# EAGLE board memory (EAGLE 6.6.0), part 1 of 9
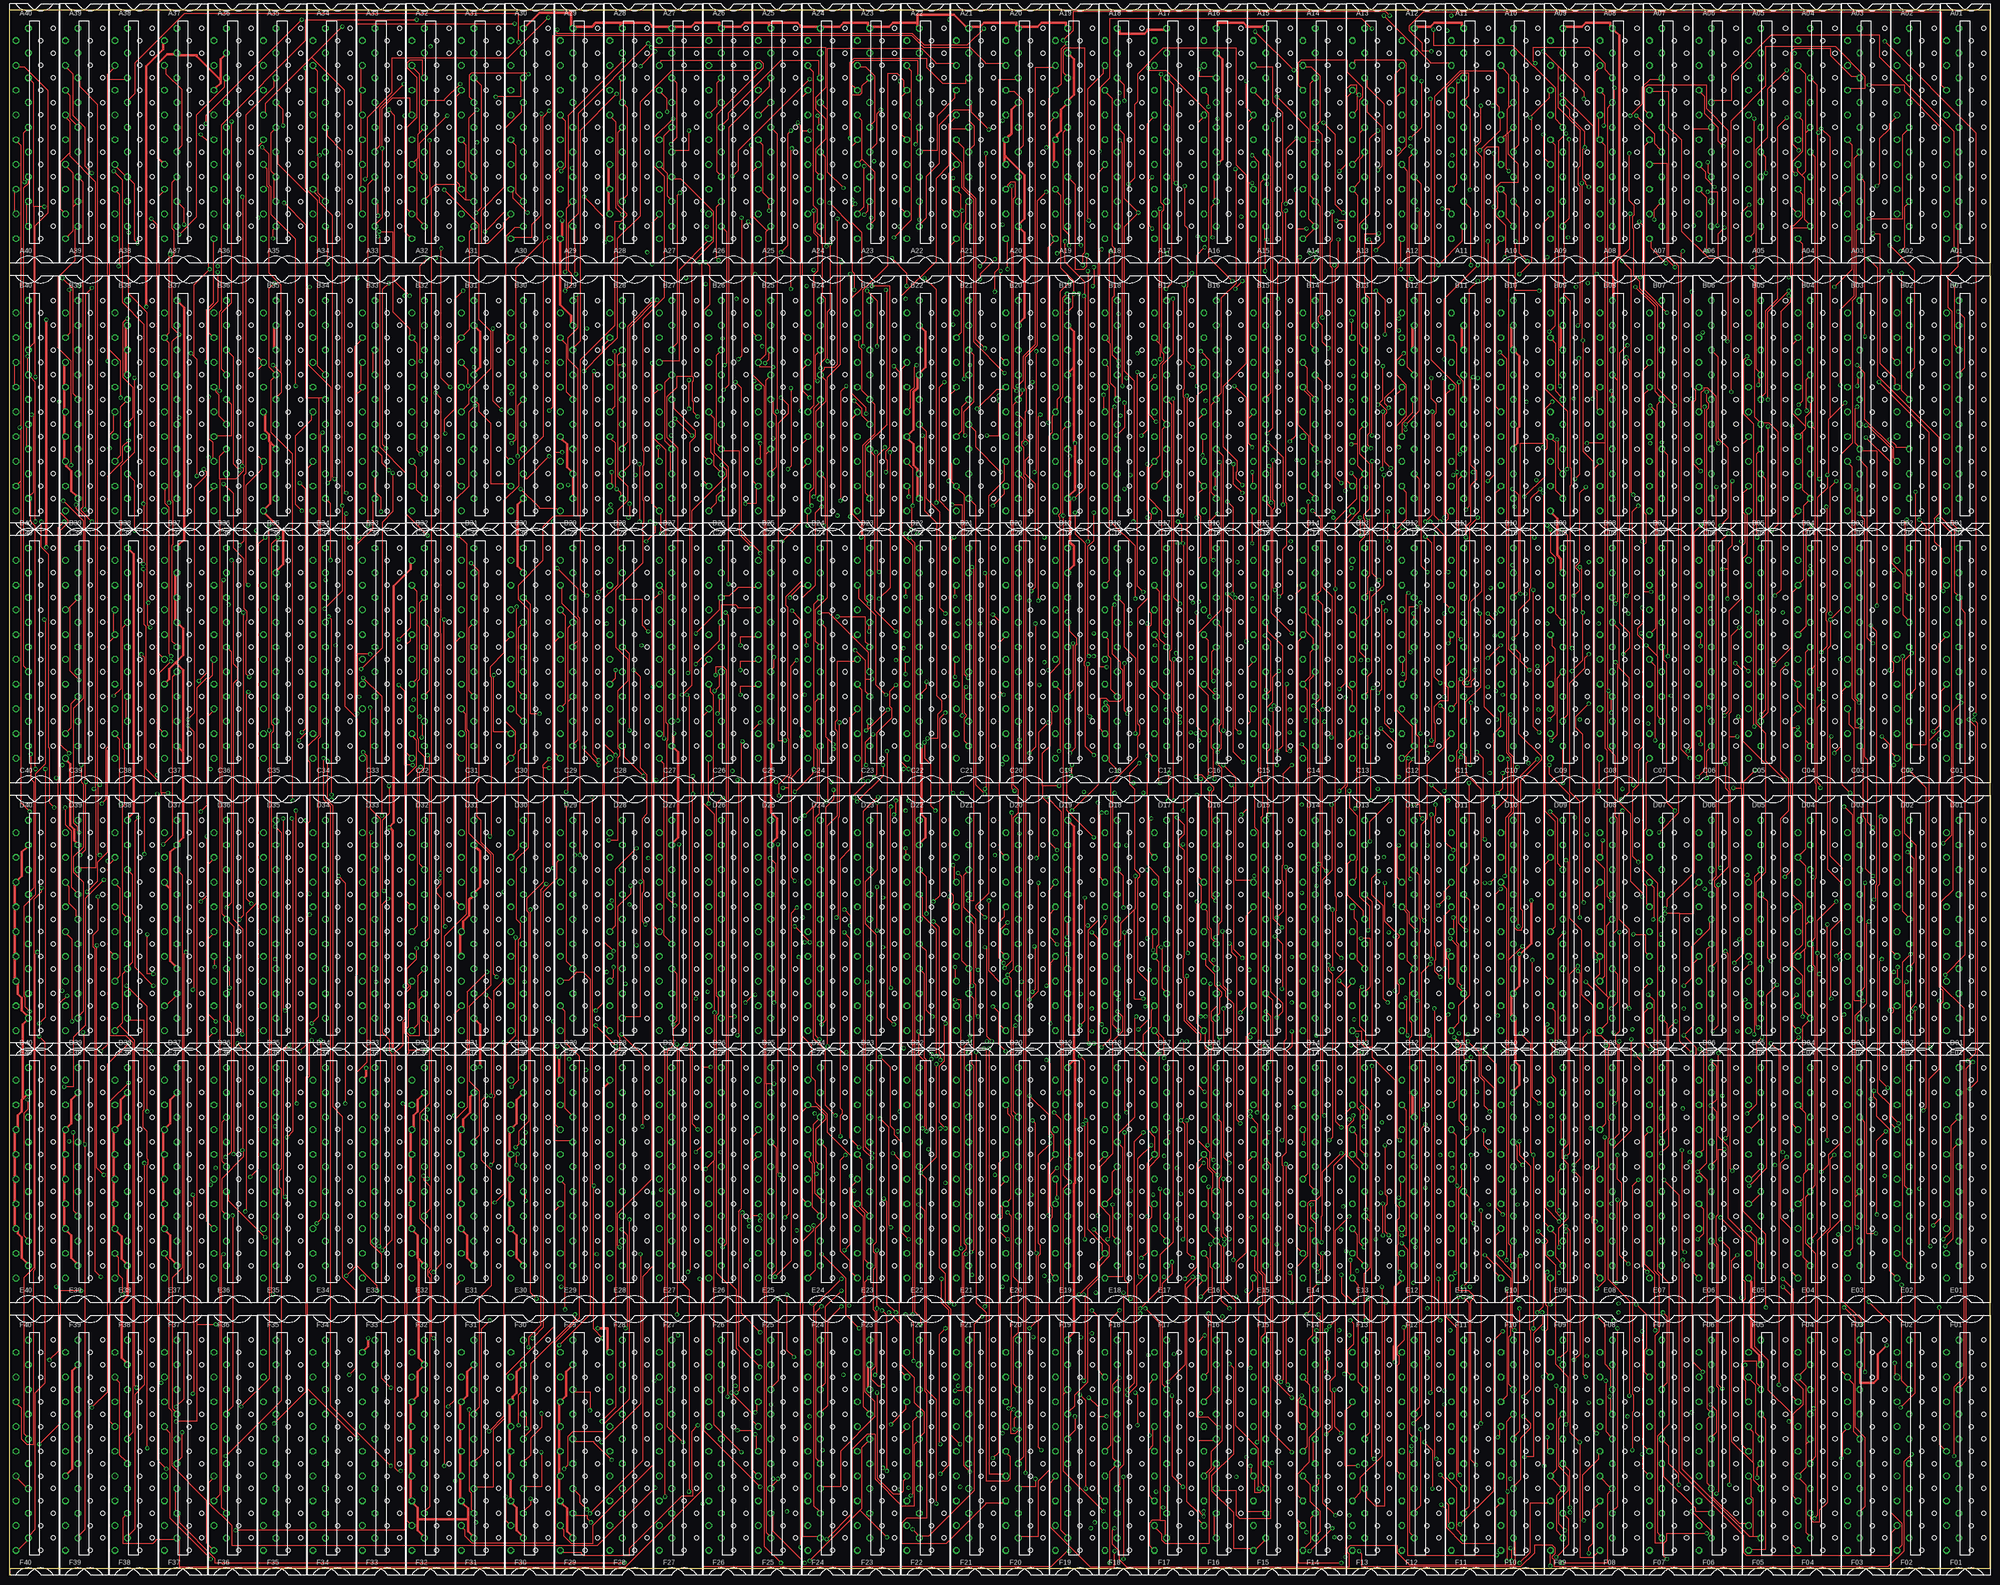
[diagram p15: board, top side]
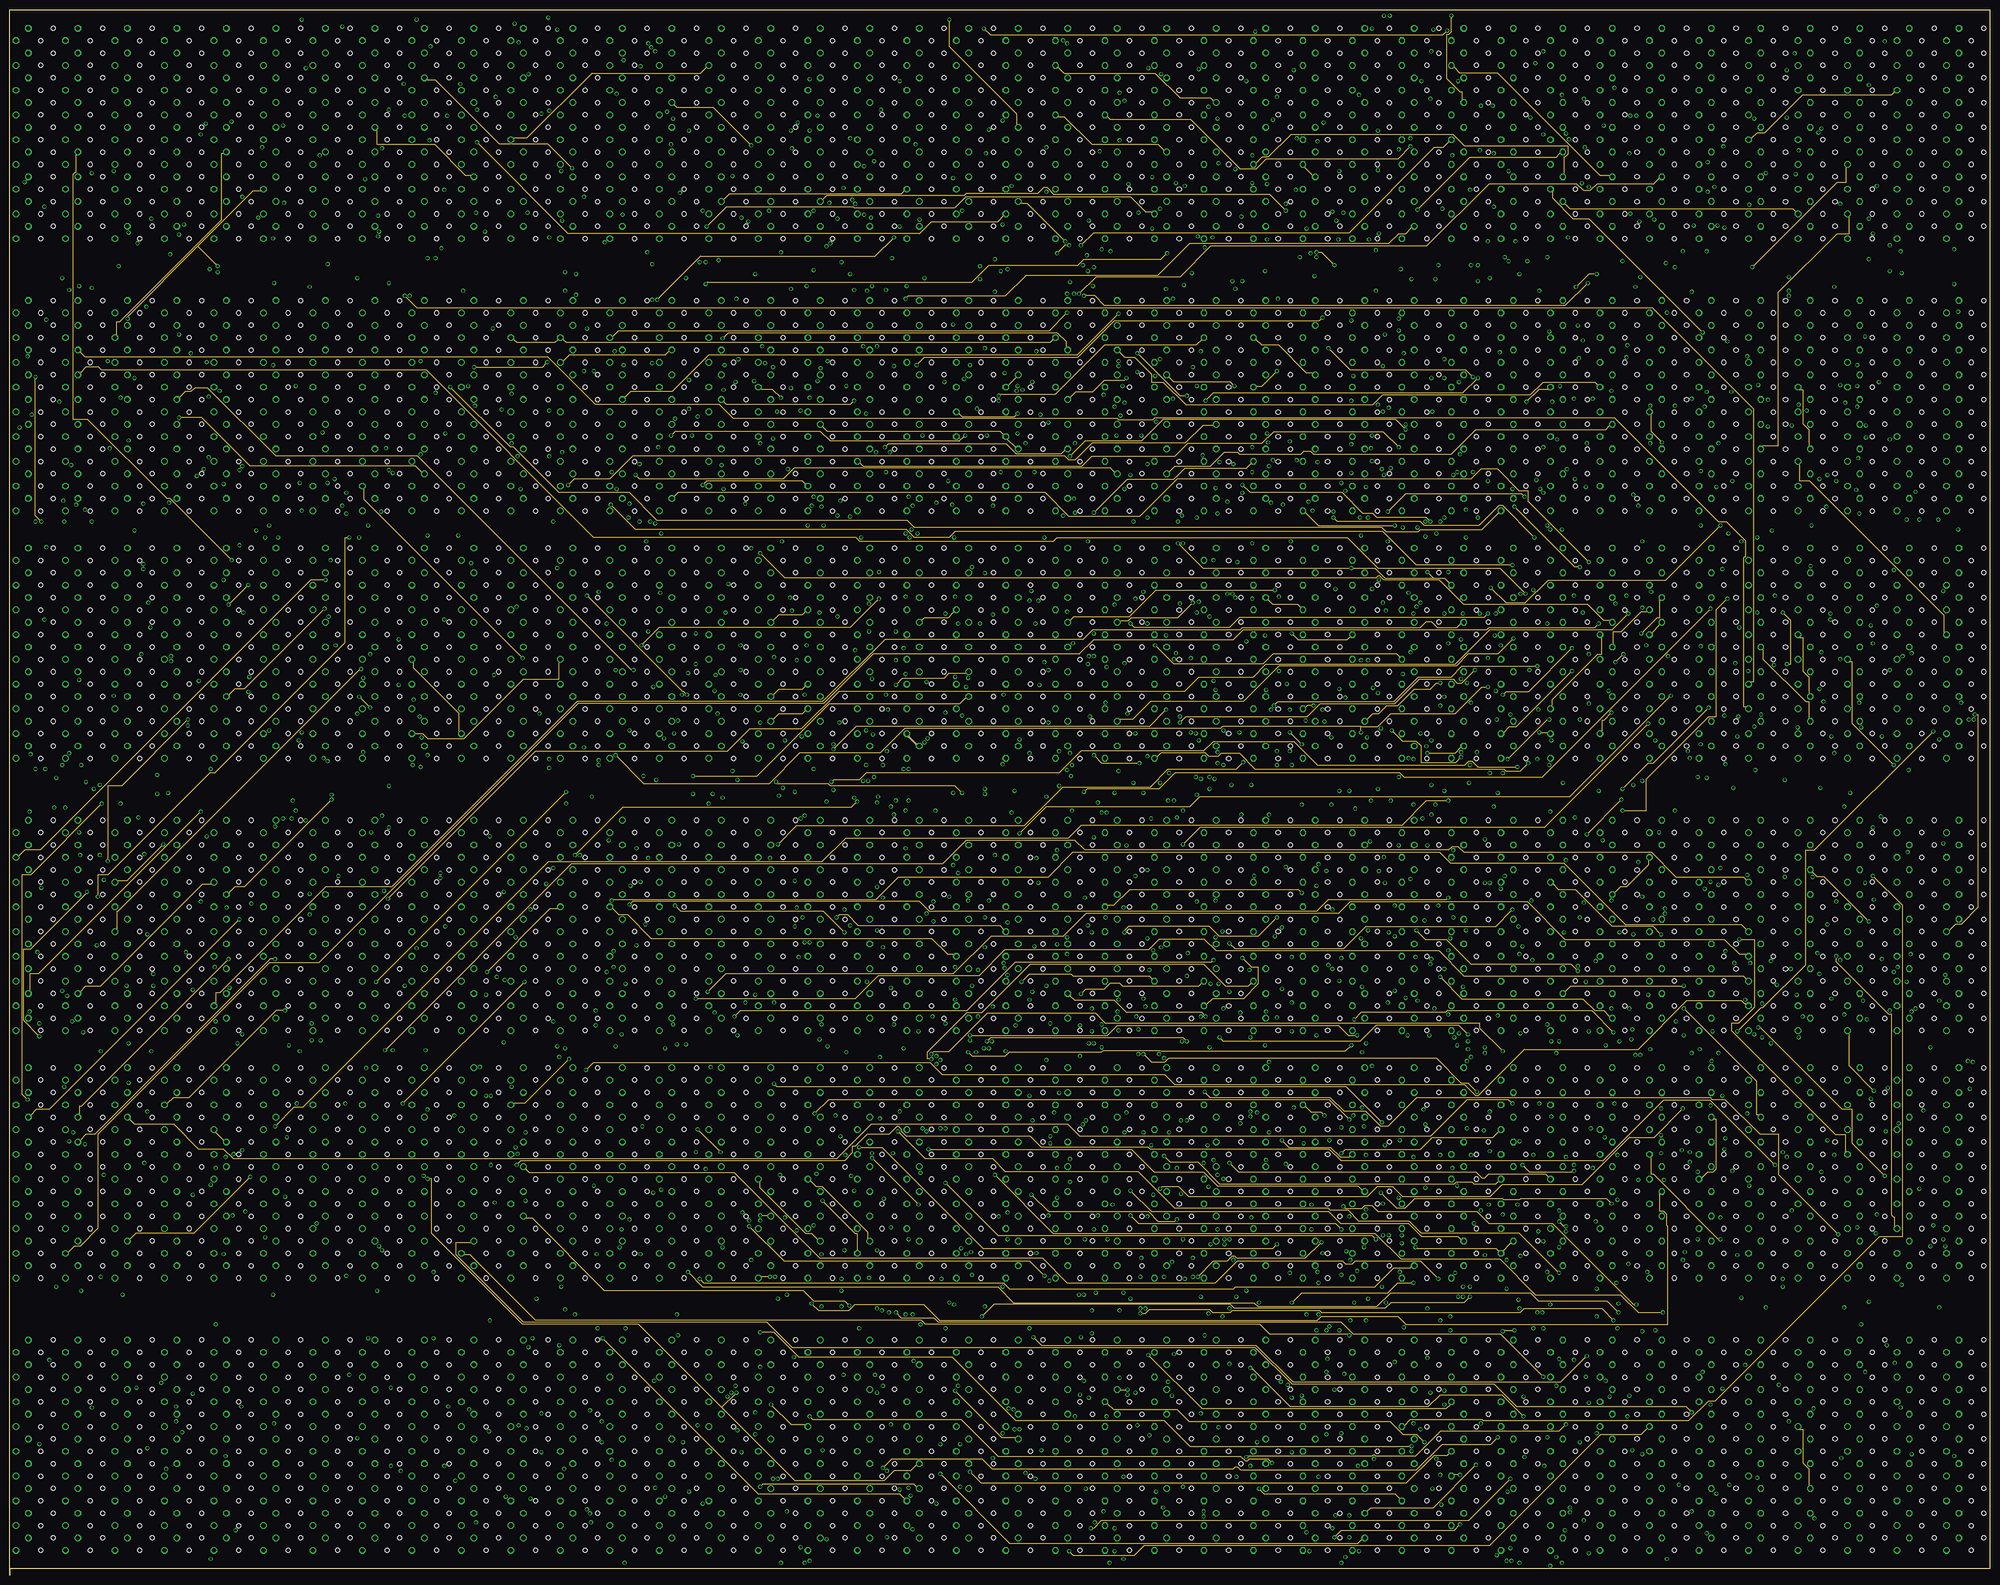
[diagram p16: board, inner layer Route2]
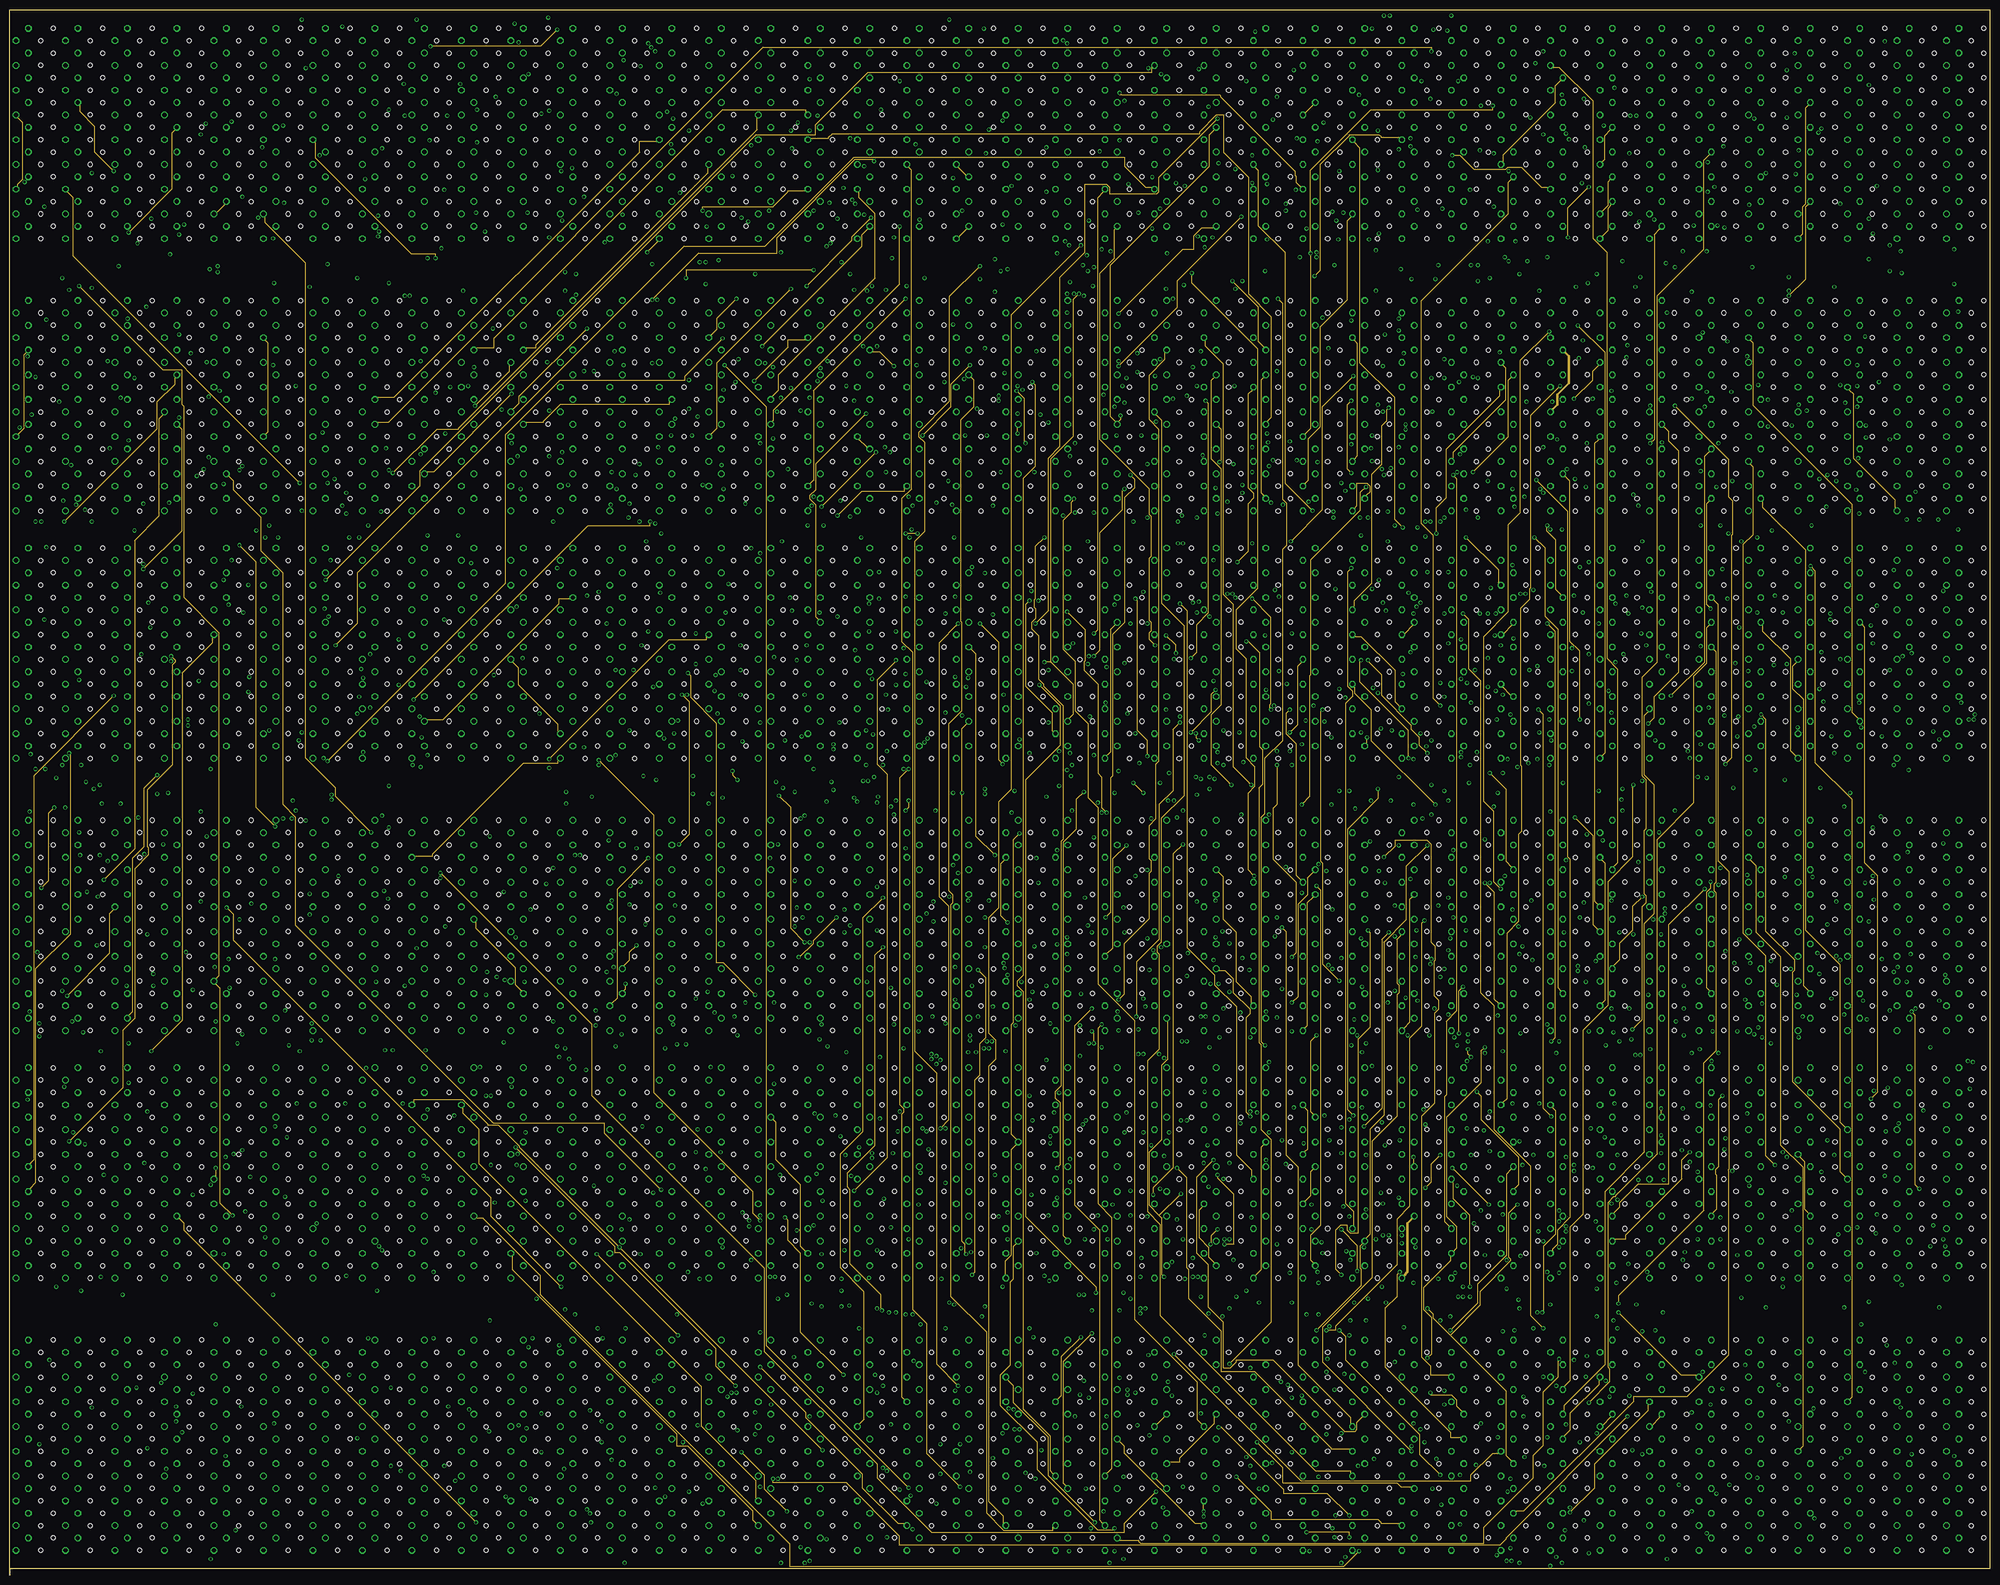
[diagram p17: board, inner layer Route3]
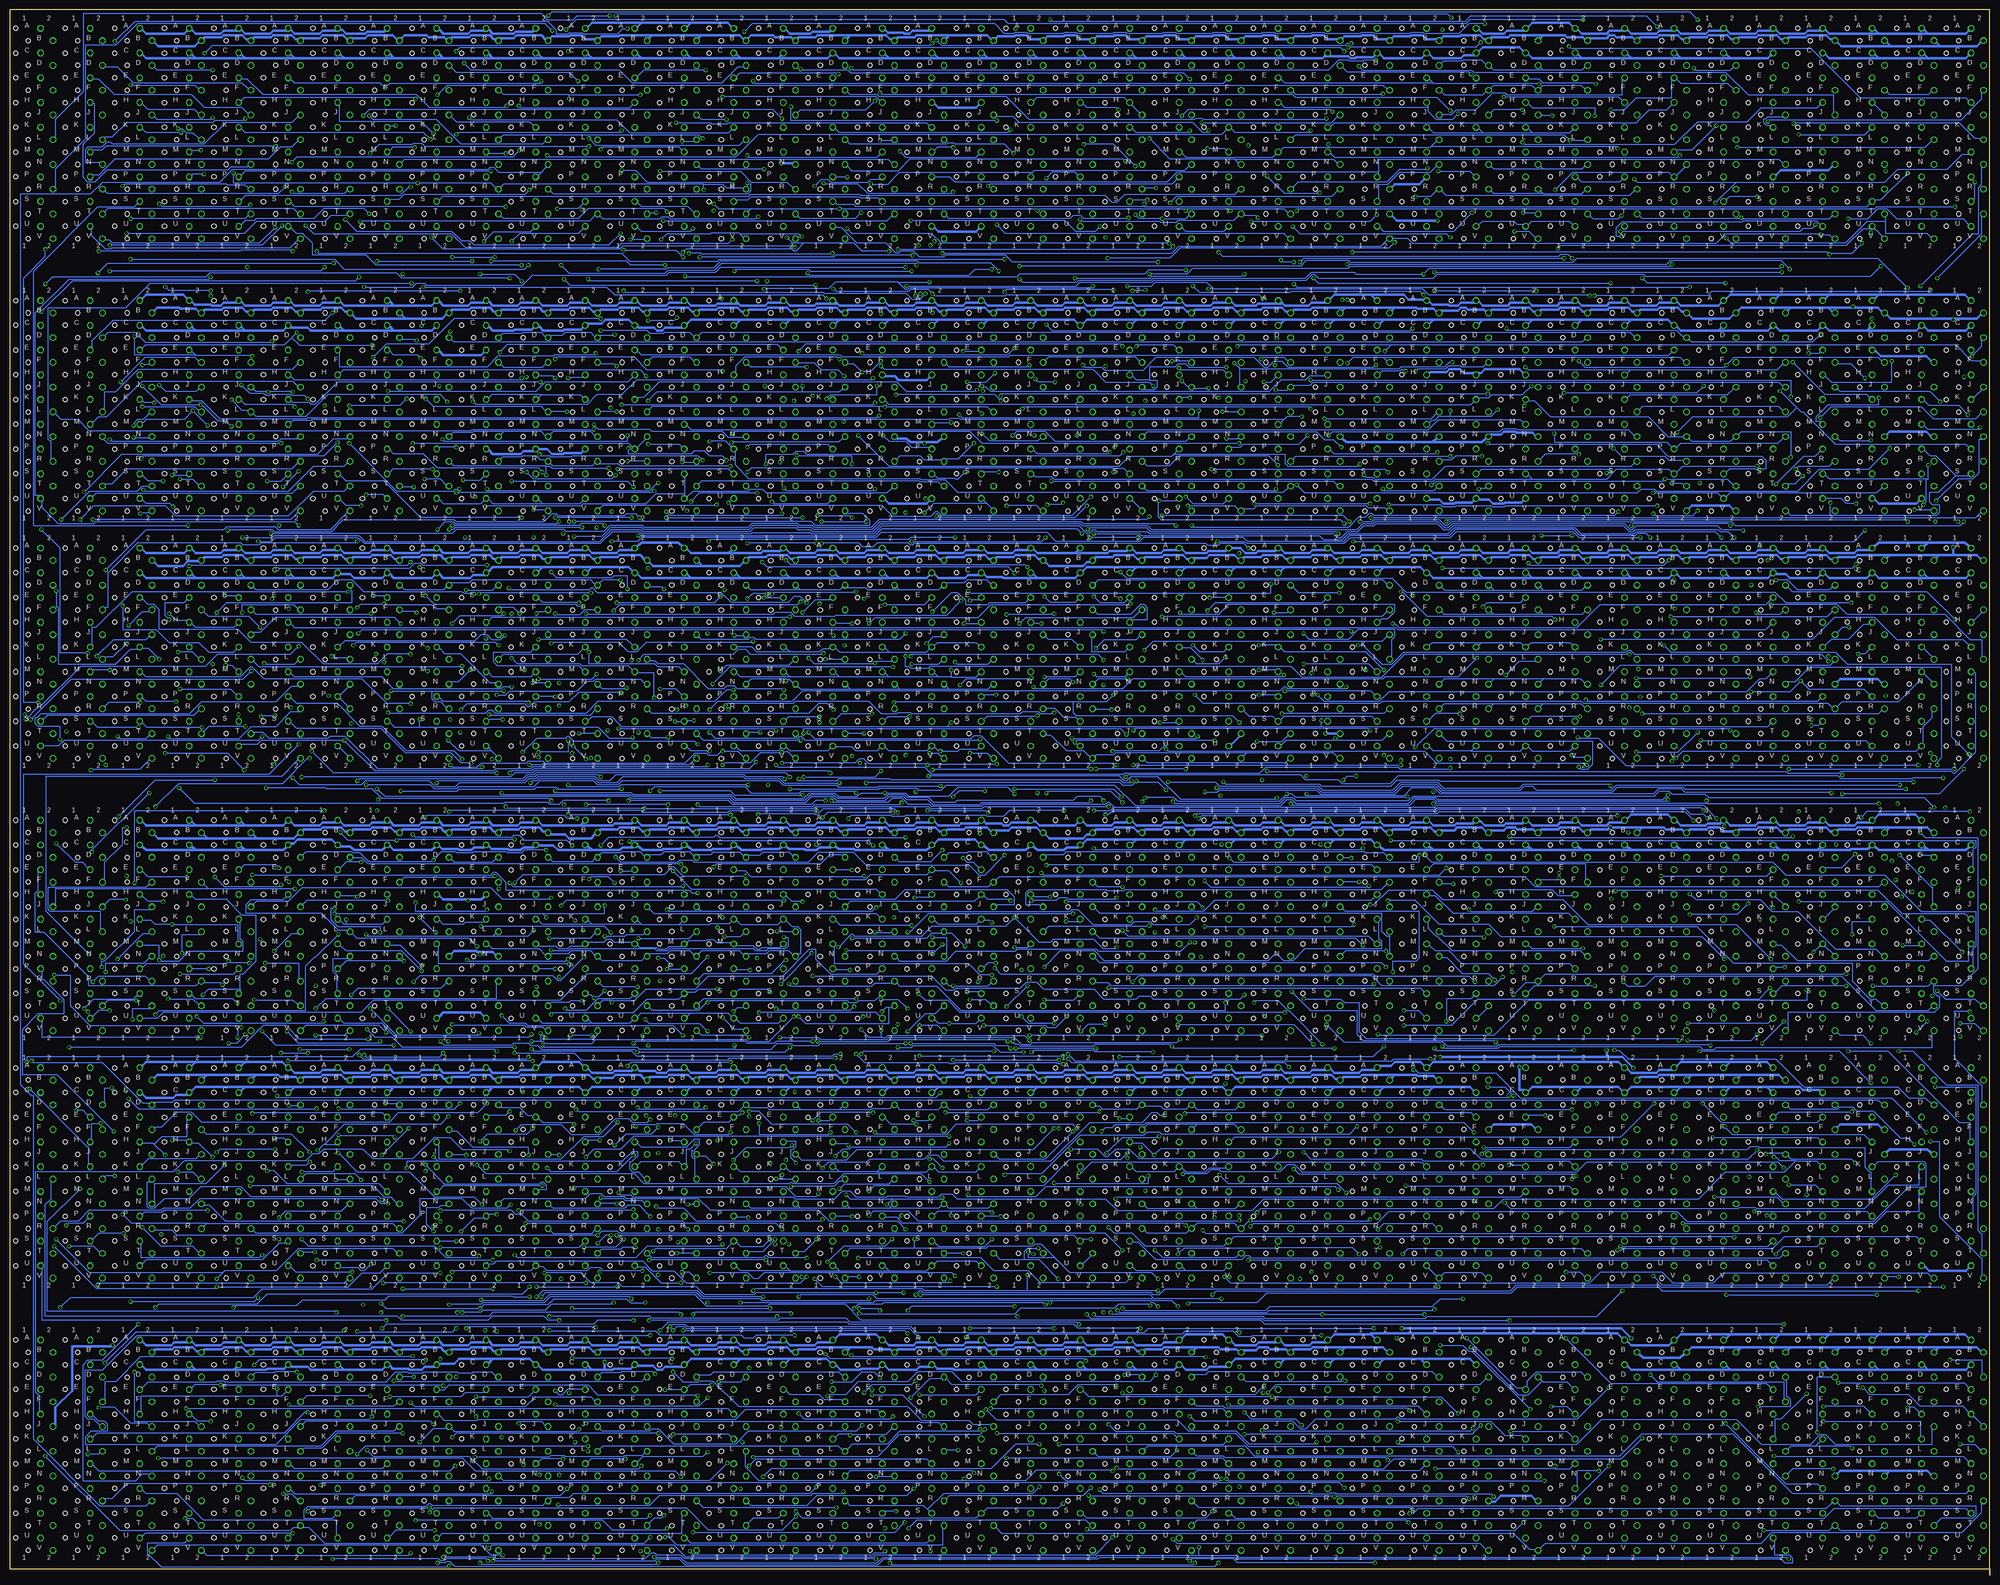
[diagram p18: board, bottom side, seen from below]

Size 508 x 401.64 mm. Coordinates in mm from the lower left corner, seen from the top.
Outline: 0,1.59 0,0 0,1.59
Outline: 0,1.59 0,401.64 508,401.64 508,1.59 0,1.59
Copper layers (1*2*3*16): Top 0.035mm / dielectric 1.5mm / Route2 0.035mm / dielectric 0.15mm / Route3 0.035mm / dielectric 0.2mm / Bottom 0.035mm
Design rules "default": minimum track width 10mil, minimum drill 24mil, track to track 8mil, track to pad 8mil, pad to pad 8mil, via to via 8mil, smd to smd 8mil, copper to edge 10mil, drill to drill 8mil, minimum pad ring 10mil, minimum via ring 8mil, stop-mask expansion 4mil, vias tented up to drill 0mil, thermal gap 10mil
Net classes: 1 Supply: width 0.635 mm

## Footprints (pad centres in the part's own frame; a part is rotated, then mirrored left to right if it is on the bottom)
H807S = drill 1.092 octagon: A2 -1.587,28.575; B2 -4.763,25.4; C2 -1.587,22.225; D2 -4.763,19.05; E2 -1.587,15.875; F2 -4.763,12.7; H2 -1.587,9.525; J2 -4.763,6.35; K2 -1.587,3.175; L2 -4.763,0; M2 -1.587,-3.175; N2 -4.763,-6.35; P2 -1.587,-9.525; R2 -4.763,-12.7; S2 -1.587,-15.875; T2 -4.763,-19.05; U2 -1.587,-22.225; V2 -4.763,-25.4 | hole 1.092: 4.763,28.575; 1.587,25.4; 4.763,22.225; 1.587,19.05; 4.763,15.875; 1.587,12.7; 4.763,9.525; 1.587,6.35; 4.763,3.175; 1.587,0; 4.763,-3.175; 1.587,-6.35; 4.763,-9.525; 1.587,-12.7; 4.763,-15.875; 1.587,-19.05; 4.763,-22.225; 1.587,-25.4

## Placement (x,y rotation side)
A01  W023S  [H807S]  501.65,368.3 0 top
A02  W023S  [H807S]  488.95,368.3 0 top
A03  R001S  [H807S]  476.25,368.3 0 top
A04  R202S  [H807S]  463.55,368.3 0 top
A05  W050S  [H807S]  450.85,368.3 0 top
A06  W050S  [H807S]  438.15,368.3 0 top
A07  W050S  [H807S]  425.45,368.3 0 top
A08  R113S  [H807S]  412.75,368.3 0 top
A09  R107S  [H807S]  400.05,368.3 0 top
A10  R113S  [H807S]  387.35,368.3 0 top
A11  R111S  [H807S]  374.65,368.3 0 top
A12  R002S  [H807S]  361.95,368.3 0 top
A13  R002S  [H807S]  349.25,368.3 0 top
A14  R111S  [H807S]  336.55,368.3 0 top
A15  R113S  [H807S]  323.85,368.3 0 top
A16  R602U  [H807S]  311.15,368.3 0 top
A17  R107S  [H807S]  298.45,368.3 0 top
A18  R107S  [H807S]  285.75,368.3 0 top
A19  R603S  [H807S]  273.05,368.3 0 top
A20  R603S  [H807S]  260.35,368.3 0 top
A21  R111S  [H807S]  247.65,368.3 0 top
A22  R001S  [H807S]  234.95,368.3 0 top
A23  R111S  [H807S]  222.25,368.3 0 top
A24  R107S  [H807S]  209.55,368.3 0 top
A25  R111S  [H807S]  196.85,368.3 0 top
A26  R113S  [H807S]  184.15,368.3 0 top
A27  R113S  [H807S]  171.45,368.3 0 top
A28  R602S  [H807S]  158.75,368.3 0 top
A29  R202S  [H807S]  146.05,368.3 0 top
A30  R202S  [H807S]  133.35,368.3 0 top
A31  R202S  [H807S]  120.65,368.3 0 top
A32  R202S  [H807S]  107.95,368.3 0 top
A33  R001S  [H807S]  95.25,368.3 0 top
A34  R111S  [H807S]  82.55,368.3 0 top
A35  R001S  [H807S]  69.85,368.3 0 top
A36  R302S  [H807S]  57.15,368.3 0 top
A37  R602S  [H807S]  44.45,368.3 0 top
A38  R111S  [H807S]  31.75,368.3 0 top
A39  R002S  [H807S]  19.05,368.3 0 top
A40  R107S  [H807S]  6.35,368.3 0 top
B01  W023S  [H807S]  501.65,298.45 0 top
B02  W023S  [H807S]  488.95,298.45 0 top
B03  W050S  [H807S]  476.25,298.45 0 top
B04  R202S  [H807S]  463.55,298.45 0 top
B05  W005S  [H807S]  450.85,298.45 0 top
B06  W050S  [H807S]  438.15,298.45 0 top
B07  W050S  [H807S]  425.45,298.45 0 top
B08  R107S  [H807S]  412.75,298.45 0 top
B09  R202S  [H807S]  400.05,298.45 0 top
B10  R202S  [H807S]  387.35,298.45 0 top
B11  R202S  [H807S]  374.65,298.45 0 top
B12  R202S  [H807S]  361.95,298.45 0 top
B13  R111S  [H807S]  349.25,298.45 0 top
B14  R002S  [H807S]  336.55,298.45 0 top
B15  R113S  [H807S]  323.85,298.45 0 top
B16  R107S  [H807S]  311.15,298.45 0 top
B17  R113S  [H807S]  298.45,298.45 0 top
B18  R603S  [H807S]  285.75,298.45 0 top
B19  R603S  [H807S]  273.05,298.45 0 top
B20  R111S  [H807S]  260.35,298.45 0 top
B21  R002S  [H807S]  247.65,298.45 0 top
B22  R603S  [H807S]  234.95,298.45 0 top
B23  R111S  [H807S]  222.25,298.45 0 top
B24  R113S  [H807S]  209.55,298.45 0 top
B25  R113S  [H807S]  196.85,298.45 0 top
B26  R002S  [H807S]  184.15,298.45 0 top
B27  R602S  [H807S]  171.45,298.45 0 top
B28  R202S  [H807S]  158.75,298.45 0 top
B29  R603S  [H807S]  146.05,298.45 0 top
B30  R603S  [H807S]  133.35,298.45 0 top
B31  R603S  [H807S]  120.65,298.45 0 top
B32  R401S  [H807S]  107.95,298.45 0 top
B33  R107S  [H807S]  95.25,298.45 0 top
B34  R202S  [H807S]  82.55,298.45 0 top
B35  R202S  [H807S]  69.85,298.45 0 top
B36  R113S  [H807S]  57.15,298.45 0 top
B37  R107S  [H807S]  44.45,298.45 0 top
B38  R603S  [H807S]  31.75,298.45 0 top
B39  W028S  [H807S]  19.05,298.45 0 top
B40  W005S  [H807S]  6.35,298.45 0 top
C01  W023S  [H807S]  501.65,234.95 0 top
C02  W023S  [H807S]  488.95,234.95 0 top
C03  W050S  [H807S]  476.25,234.95 0 top
C04  R202S  [H807S]  463.55,234.95 0 top
C05  R107S  [H807S]  450.85,234.95 0 top
C06  W050S  [H807S]  438.15,234.95 0 top
C07  R111S  [H807S]  425.45,234.95 0 top
C08  R002S  [H807S]  412.75,234.95 0 top
C09  R107S  [H807S]  400.05,234.95 0 top
C10  R111S  [H807S]  387.35,234.95 0 top
C11  R001S  [H807S]  374.65,234.95 0 top
C12  R111S  [H807S]  361.95,234.95 0 top
C13  R107S  [H807S]  349.25,234.95 0 top
C14  R113S  [H807S]  336.55,234.95 0 top
C15  R202S  [H807S]  323.85,234.95 0 top
C16  R202S  [H807S]  311.15,234.95 0 top
C17  R202S  [H807S]  298.45,234.95 0 top
C18  R202S  [H807S]  285.75,234.95 0 top
C19  R202S  [H807S]  273.05,234.95 0 top
C20  R202S  [H807S]  260.35,234.95 0 top
C21  R107S  [H807S]  247.65,234.95 0 top
C22  M517S  [H807S]  234.95,234.95 0 top
C23  W512S  [H807S]  222.25,234.95 0 top
C24  R107S  [H807S]  209.55,234.95 0 top
C25  M517S  [H807S]  196.85,234.95 0 top
C26  W512S  [H807S]  184.15,234.95 0 top
C27  M517S  [H807S]  171.45,234.95 0 top
C28  W023S  [H807S]  158.75,234.95 0 top
C29  R202S  [H807S]  146.05,234.95 0 top
C30  R202S  [H807S]  133.35,234.95 0 top
C31  R202S  [H807S]  120.65,234.95 0 top
C32  R202S  [H807S]  107.95,234.95 0 top
C33  EMPTYS  [H807S]  95.25,234.95 0 top
C34  EMPTYS  [H807S]  82.55,234.95 0 top
C35  EMPTYS  [H807S]  69.85,234.95 0 top
C36  R107S  [H807S]  57.15,234.95 0 top
C37  R603S  [H807S]  44.45,234.95 0 top
C38  R602S  [H807S]  31.75,234.95 0 top
C39  W501S  [H807S]  19.05,234.95 0 top
C40  W506S  [H807S]  6.35,234.95 0 top
D01  W023S  [H807S]  501.65,165.1 0 top
D02  W023S  [H807S]  488.95,165.1 0 top
D03  W050S  [H807S]  476.25,165.1 0 top
D04  R202S  [H807S]  463.55,165.1 0 top
D05  R107S  [H807S]  450.85,165.1 0 top
D06  R113S  [H807S]  438.15,165.1 0 top
D07  R113S  [H807S]  425.45,165.1 0 top
D08  R113S  [H807S]  412.75,165.1 0 top
D09  R603S  [H807S]  400.05,165.1 0 top
D10  R603S  [H807S]  387.35,165.1 0 top
D11  R202S  [H807S]  374.65,165.1 0 top
D12  R202S  [H807S]  361.95,165.1 0 top
D13  R202S  [H807S]  349.25,165.1 0 top
D14  R202S  [H807S]  336.55,165.1 0 top
D15  R202S  [H807S]  323.85,165.1 0 top
D16  R202S  [H807S]  311.15,165.1 0 top
D17  R151S  [H807S]  298.45,165.1 0 top
D18  R107S  [H807S]  285.75,165.1 0 top
D19  R202S  [H807S]  273.05,165.1 0 top
D20  R202S  [H807S]  260.35,165.1 0 top
D21  M507S  [H807S]  247.65,165.1 0 top
D22  M507S  [H807S]  234.95,165.1 0 top
D23  EMPTYS  [H807S]  222.25,165.1 0 top
D24  EMPTYS  [H807S]  209.55,165.1 0 top
D25  EMPTYS  [H807S]  196.85,165.1 0 top
D26  EMPTYS  [H807S]  184.15,165.1 0 top
D27  M507S  [H807S]  171.45,165.1 0 top
D28  W023S  [H807S]  158.75,165.1 0 top
D29  R107S  [H807S]  146.05,165.1 0 top
D30  R401S  [H807S]  133.35,165.1 0 top
D31  R603S  [H807S]  120.65,165.1 0 top
D32  R113S  [H807S]  107.95,165.1 0 top
D33  EMPTYS  [H807S]  95.25,165.1 0 top
D34  EMPTYS  [H807S]  82.55,165.1 0 top
D35  EMPTYS  [H807S]  69.85,165.1 0 top
D36  R111S  [H807S]  57.15,165.1 0 top
D37  R302S  [H807S]  44.45,165.1 0 top
D38  R202S  [H807S]  31.75,165.1 0 top
D39  R002S  [H807S]  19.05,165.1 0 top
D40  W028S  [H807S]  6.35,165.1 0 top
E01  W023S  [H807S]  501.65,101.6 0 top
E02  W023S  [H807S]  488.95,101.6 0 top
E03  R001S  [H807S]  476.25,101.6 0 top
E04  R202S  [H807S]  463.55,101.6 0 top
E05  W501S  [H807S]  450.85,101.6 0 top
E06  R202S  [H807S]  438.15,101.6 0 top
E07  W050S  [H807S]  425.45,101.6 0 top
E08  W005S  [H807S]  412.75,101.6 0 top
E09  R113S  [H807S]  400.05,101.6 0 top
E10  R113S  [H807S]  387.35,101.6 0 top
E11  R113S  [H807S]  374.65,101.6 0 top
E12  R202S  [H807S]  361.95,101.6 0 top
E13  R113S  [H807S]  349.25,101.6 0 top
E14  R113S  [H807S]  336.55,101.6 0 top
E15  R202S  [H807S]  323.85,101.6 0 top
E16  R202S  [H807S]  311.15,101.6 0 top
E17  R202S  [H807S]  298.45,101.6 0 top
E18  R202S  [H807S]  285.75,101.6 0 top
E19  R202S  [H807S]  273.05,101.6 0 top
E20  R202S  [H807S]  260.35,101.6 0 top
E21  EMPTYS  [H807S]  247.65,101.6 0 top
E22  R401S  [H807S]  234.95,101.6 0 top
E23  R202S  [H807S]  222.25,101.6 0 top
E24  R202S  [H807S]  209.55,101.6 0 top
E25  R202S  [H807S]  196.85,101.6 0 top
E26  EMPTYS  [H807S]  184.15,101.6 0 top
E27  EMPTYS  [H807S]  171.45,101.6 0 top
E28  EMPTYS  [H807S]  158.75,101.6 0 top
E29  R111S  [H807S]  146.05,101.6 0 top
E30  W021S  [H807S]  133.35,101.6 0 top
E31  W021S  [H807S]  120.65,101.6 0 top
E32  W021S  [H807S]  107.95,101.6 0 top
E33  EMPTYS  [H807S]  95.25,101.6 0 top
E34  EMPTYS  [H807S]  82.55,101.6 0 top
E35  EMPTYS  [H807S]  69.85,101.6 0 top
E36  R113S  [H807S]  57.15,101.6 0 top
E37  W028S  [H807S]  44.45,101.6 0 top
E38  W028S  [H807S]  31.75,101.6 0 top
E39  W028S  [H807S]  19.05,101.6 0 top
E40  W028S  [H807S]  6.35,101.6 0 top
F01  W023S  [H807S]  501.65,31.75 0 top
F02  W023S  [H807S]  488.95,31.75 0 top
F03  R202S  [H807S]  476.25,31.75 0 top
F04  R202S  [H807S]  463.55,31.75 0 top
F05  R202S  [H807S]  450.85,31.75 0 top
F06  R001S  [H807S]  438.15,31.75 0 top
F07  R111S  [H807S]  425.45,31.75 0 top
F08  R111S  [H807S]  412.75,31.75 0 top
F09  R111S  [H807S]  400.05,31.75 0 top
F10  R107S  [H807S]  387.35,31.75 0 top
F11  R107S  [H807S]  374.65,31.75 0 top
F12  R107S  [H807S]  361.95,31.75 0 top
F13  R107S  [H807S]  349.25,31.75 0 top
F14  R113S  [H807S]  336.55,31.75 0 top
F15  R111S  [H807S]  323.85,31.75 0 top
F16  R001S  [H807S]  311.15,31.75 0 top
F17  R111S  [H807S]  298.45,31.75 0 top
F18  R107S  [H807S]  285.75,31.75 0 top
F19  R107S  [H807S]  273.05,31.75 0 top
F20  R107S  [H807S]  260.35,31.75 0 top
F21  EMPTYS  [H807S]  247.65,31.75 0 top
F22  W005S  [H807S]  234.95,31.75 0 top
F23  R202S  [H807S]  222.25,31.75 0 top
F24  R107S  [H807S]  209.55,31.75 0 top
F25  R107S  [H807S]  196.85,31.75 0 top
F26  EMPTYS  [H807S]  184.15,31.75 0 top
F27  EMPTYS  [H807S]  171.45,31.75 0 top
F28  EMPTYS  [H807S]  158.75,31.75 0 top
F29  W021S  [H807S]  146.05,31.75 0 top
F30  W021S  [H807S]  133.35,31.75 0 top
F31  W021S  [H807S]  120.65,31.75 0 top
F32  W021S  [H807S]  107.95,31.75 0 top
F33  EMPTYS  [H807S]  95.25,31.75 0 top
F34  EMPTYS  [H807S]  82.55,31.75 0 top
F35  EMPTYS  [H807S]  69.85,31.75 0 top
F36  R113S  [H807S]  57.15,31.75 0 top
F37  R602S  [H807S]  44.45,31.75 0 top
F38  R602S  [H807S]  31.75,31.75 0 top
F39  R602S  [H807S]  19.05,31.75 0 top
F40  R111S  [H807S]  6.35,31.75 0 top

## Tracks (layer width: path | path; a pad name or v marks a point on that pad's centre or on a via)
!RAMA00
  Bottom 0.254: D28.D2 154.69,184.47 155.45,185.23 160.02,185.23 160.27,185.48 236.98,185.48 237.74,184.72 242.32,184.72 D21.D2
!RAMA01  (via drill 0.61)
  Top 0.254: v242.06,182.18 242.32,181.93 242.32,178.37 D21.F2
  Bottom 0.254: v242.06,182.18 158.5,182.18 157.73,181.42 D28.E2
!RAMA02
  Bottom 0.254: D28.F2 154.69,177.36 156.21,175.83 222,175.83 222.25,175.58 226.31,175.58 226.57,175.83 246.63,175.83 247.4,175.07 247.4,172.02 243.33,172.02 D21.J2
!RAMA03  (via drill 0.61)
  Top 0.254: v214.12,170.75 215.65,169.23 v215.65,166.69
  Bottom 0.254: v214.12,170.75 213.61,170.24 201.68,170.24 198.88,173.04 158.75,173.04 157.73,174.05 D28.H2 | v215.65,166.69 215.9,166.43 241.55,166.43 242.32,165.67 D21.L2
!RAMA04
  Route2 0.254: D28.J2 154.69,171.01 156.21,169.48 158.5,169.48 164.59,163.39 236.47,163.39 240.54,159.32 242.32,159.32 D21.N2
!RAMA05  (via drill 0.61)
  Top 0.254: v242.57,156.02 242.57,152.97 D21.R2
  Bottom 0.254: v242.57,156.02 238.51,160.08 229.62,160.08 227.08,157.54 185.17,157.54 183.64,159.07 182.63,159.07 181.1,157.54 178.82,157.54 175.77,160.59 155.96,160.59 155.96,162.62 156.46,163.13 156.72,163.13 156.72,167.7 D28.K2
!RAMA06  (via drill 0.61)
  Top 0.254: v160.78,186.5 155.45,181.17 155.45,166.69 154.43,165.67 D28.L2 | v229.87,186.5 229.87,184.72 D22.D2
  Bottom 0.254: v160.78,186.5 161.29,185.99 229.36,185.99 v229.87,186.5
!RAMA07  (via drill 0.61)
  Top 0.254: v222.5,165.42 v222.5,176.59
  Bottom 0.254: v222.5,165.42 220.98,163.89 159.26,163.89 157.73,162.37 D28.M2 | v222.5,176.59 228.85,176.59 229.62,177.36 D22.F2
!RAMA08
  Bottom 0.254: D28.N2 153.92,159.32 153.92,163.89 154.69,163.89 155.96,165.16 155.96,169.74 228.35,169.74 229.62,171.01 D22.J2
!RAMA09  (via drill 0.61)
  Route3 0.254: v160.78,161.61 159,159.83 159,157.8 157.48,156.27 D28.P2
  Bottom 0.254: v160.78,161.61 162.56,163.39 228.35,163.39 229.62,164.66 D22.L2
!RAMA10  (via drill 0.61)
  Top 0.254: v154.94,156.02 154.94,153.48 154.43,152.97 D28.R2
  Bottom 0.254: v154.94,156.02 155.96,157.04 228.35,157.04 229.62,158.31 D22.N2
!RAMA11  (via drill 0.61)
  Route3 0.254: v157.99,151.7 157.99,150.43 157.48,149.92 D28.S2
  Bottom 0.254: v157.99,151.7 158.5,151.19 225.3,151.19 226.06,151.96 229.62,151.96 D22.R2
!RAMA12  (via drill 0.61)
  Route3 0.254: v163.83,183.96 155.96,176.09 155.96,148.15 154.43,146.62 D28.T2
  Bottom 0.254: v163.83,183.96 166.12,183.96 D27.D2
!RAMA13  (via drill 0.61)
  Top 0.254: v161.8,177.86 161.8,143.32 157.73,143.32 D28.U2
  Bottom 0.254: v161.8,177.86 166.12,177.86 D27.F2
!RAMA14  (via drill 0.61)
  Top 0.254: v153.16,154.75 152.65,154.24 152.65,141.03 153.42,140.27 D28.V2
  Bottom 0.254: v153.16,154.75 153.16,157.54 147.07,157.54 146.3,158.31 146.3,170.24 165.35,170.24 166.12,171.01 D27.J2
!RD  (via drill 0.61)
  Top 0.254: v154.94,160.08 152.65,162.37 152.65,207.84 153.67,208.85 C28.V2
  Bottom 0.254: v154.94,160.08 165.35,160.08 166.12,159.32 D27.N2
!WR  (via drill 0.61)
  Top 0.254: v165.86,204.03 165.35,203.52 165.35,166.43 166.12,165.67 D27.L2 | v162.56,205.04 157.73,209.87 157.73,212.15 C28.U2
  Bottom 0.254: v165.86,204.03 164.85,205.04 v162.56,205.04
(ISZ*ZI)+JMS+(OP+IOT)*SKP  (via drill 0.61)
  Top 0.254: v318.26,28 318.52,27.75 318.52,25.97 F15.N2 319.53,24.7 319.53,21.15 320.8,21.15 321.56,21.91 F15.P2 321.82,22.92 321.06,23.69 321.06,61.02 322.07,62.04 322.07,77.03 321.06,78.04 321.06,194.37 321.56,194.88 321.56,203.52 321.06,204.03 321.06,357.44 321.82,358.2 A15.P2
  Bottom 0.254: v318.26,28 316.48,29.78 272.8,29.78 272.03,29.02 F19.M2
(LAS+DEPS+EXS)  (via drill 0.61)
  Top 0.254: v51.05,302.32 51.05,291.66 52.07,290.64 52.07,286.32 B36.R2 | v174.24,299.28 v174.24,306.64 | v248.16,299.28 253.24,304.36 255.02,304.36 B20.J2
  Route2 0.254: B20.H2 258.32,307.4 256.29,305.37 256.03,305.37 B20.J2
  Bottom 0.254: v51.05,302.32 51.05,306.64 v174.24,306.64 | v174.24,299.28 174.75,299.78 247.65,299.78 v248.16,299.28
-15V  (via drill 0.61)
  Top 0.635: v35.05,325.44 35.05,387.16 39.37,391.48 39.37,393 A37.B2 | C32.B2 102.87,259.65 102.87,258.13 98.55,253.81 98.55,193.1 v97.28,191.83 97.54,191.83 98.3,191.07 v98.3,134.68 | v91.44,130.11 91.44,128.08 90.93,127.57 E33.B2 | v140.97,132.91 140.97,127.57 E29.B2 | v91.95,60.77 91.95,58.74 90.93,57.72 F33.B2 | 152.4,63.31 153.42,63.31 153.42,57.72 F28.B2 | 152.4,63.31 v150.88,63.31 | E28.B2 153.67,126.3 152.4,125.03 152.4,63.56 152.4,63.31 | v9.4,263.72 v9.4,322.14
  Bottom 0.635: 9.4,322.39 25.4,322.39 26.42,323.41 B38.B2 27.69,324.17 28.7,325.18 35.05,325.18 | 9.4,322.39 3.3,322.39 2.29,323.41 B40.B2 | 41.27,325.06 41.4,325.18 51.05,325.18 | 41.27,325.06 40.39,324.17 B37.B2 | 51.05,325.18 51.82,324.42 B36.B2 | 51.05,325.18 51.31,325.18 63.75,325.18 64.52,324.42 B35.B2 65.79,323.41 66.8,322.39 76.2,322.39 77.22,323.41 B34.B2 78.49,324.17 78.99,324.17 80.01,325.18 84.84,325.18 85.34,324.68 89.66,324.68 89.92,324.42 B33.B2 91.19,324.17 91.69,324.17 92.71,325.18 97.54,325.18 98.04,324.68 102.36,324.68 102.62,324.42 B32.B2 103.89,324.17 104.39,324.17 105.41,325.18 110.24,325.18 110.74,324.68 115.06,324.68 115.32,324.42 B31.B2 116.59,324.17 117.09,324.17 118.11,325.18 122.94,325.18 123.44,324.68 127.76,324.68 128.02,324.42 B30.B2 129.29,324.17 129.79,324.68 133.86,324.68 134.37,325.18 135.64,325.18 136.4,324.42 140.72,324.42 B29.B2 141.99,324.17 142.75,324.93 146.81,324.93 147.07,325.18 152.65,325.18 | 35.05,325.18 41.15,325.18 41.27,325.06 | B03.B2 470.92,324.42 470.15,325.18 464.57,325.18 464.31,324.93 460.25,324.93 459.49,324.17 B04.B2 458.22,324.42 457.96,324.68 453.64,324.68 453.14,325.18 448.31,325.18 447.29,324.17 446.79,324.17 B05.B2 445.52,324.42 445.26,324.68 440.94,324.68 440.44,325.18 435.61,325.18 434.59,324.17 434.09,324.17 B06.B2 432.82,324.42 432.56,324.68 428.24,324.68 427.74,325.18 422.91,325.18 421.89,324.17 421.39,324.17 B07.B2 420.12,323.41 419.1,322.39 406.65,322.39 406.4,322.39 | 406.4,322.39 397,322.39 395.99,323.41 B09.B2 394.72,324.42 394.46,324.68 390.14,324.68 389.64,325.18 384.81,325.18 383.79,324.17 383.29,324.17 B10.B2 382.02,324.42 381.76,324.68 377.44,324.68 376.94,325.18 372.11,325.18 371.09,324.17 370.59,324.17 B11.B2 369.32,324.42 369.06,324.68 364.74,324.68 364.24,325.18 359.41,325.18 358.39,324.17 357.89,324.17 B12.B2 356.62,324.42 356.36,324.68 352.04,324.68 351.54,325.18 346.71,325.18 345.69,324.17 345.19,324.17 B13.B2 343.92,324.42 343.66,324.68 339.34,324.68 338.84,325.18 334.01,325.18 332.99,324.17 332.49,324.17 B14.B2 331.22,324.42 330.96,324.68 326.64,324.68 326.14,325.18 321.31,325.18 320.29,324.17 319.79,324.17 B15.B2 318.52,324.42 318.26,324.68 313.94,324.68 313.44,325.18 308.61,325.18 307.59,324.17 307.09,324.17 B16.B2 305.82,324.42 305.56,324.68 301.24,324.68 300.74,325.18 295.91,325.18 294.89,324.17 294.39,324.17 B17.B2 293.12,324.42 292.86,324.68 288.54,324.68 288.04,325.18 283.21,325.18 282.19,324.17 281.69,324.17 B18.B2 280.42,324.42 280.16,324.68 275.84,324.68 275.34,325.18 270.51,325.18 269.49,324.17 268.99,324.17 B19.B2 267.72,324.42 267.46,324.68 263.14,324.68 262.64,325.18 257.81,325.18 256.79,324.17 256.29,324.17 B20.B2 255.02,324.42 254.76,324.68 250.44,324.68 249.94,325.18 245.11,325.18 244.09,324.17 243.59,324.17 B21.B2 242.32,324.42 242.06,324.68 237.74,324.68 237.24,325.18 232.41,325.18 231.39,324.17 230.89,324.17 B22.B2 229.62,324.42 229.36,324.68 225.04,324.68 224.54,325.18 219.71,325.18 218.69,324.17 218.19,324.17 B23.B2 216.92,324.42 216.66,324.68 212.34,324.68 211.84,325.18 207.01,325.18 205.99,324.17 205.49,324.17 B24.B2 204.22,324.42 203.96,324.68 199.64,324.68 199.14,325.18 194.31,325.18 193.29,324.17 192.79,324.17 B25.B2 191.52,324.42 191.26,324.68 186.94,324.68 186.44,325.18 181.61,325.18 180.59,324.17 180.09,324.17 B26.B2 178.82,324.42 178.56,324.68 174.24,324.68 173.74,325.18 165.61,325.18 165.48,325.06
  Bottom 0.635: 406.4,322.39 407.42,323.41 B08.B2 | 152.65,325.18 153.42,324.42 B28.B2 | 165.48,325.06 165.35,325.18 152.91,325.18 152.65,325.18 | 165.48,325.06 166.12,324.42 B27.B2 | A03.B2 470.92,393.26 469.9,392.24 460.5,392.24 459.49,393.26 A04.B2 458.22,394.27 457.96,394.53 453.64,394.53 453.14,395.03 448.31,395.03 447.29,394.02 446.79,394.02 A05.B2 445.52,394.27 445.26,394.53 440.94,394.53 440.44,395.03 435.61,395.03 434.59,394.02 434.09,394.02 A06.B2 432.82,394.27 428.5,394.27 427.74,395.03 422.4,395.03 421.39,394.02 A07.B2 420.12,394.27 416.81,394.27 416.05,395.03 409.7,395.03 408.69,394.02 A08.B2 407.42,394.27 406.65,395.03 401.07,395.03 400.56,394.53 396.49,394.53 395.99,394.02 A09.B2 394.72,394.27 394.46,394.53 390.14,394.53 389.64,395.03 384.81,395.03 383.79,394.02 383.29,394.02 A10.B2 382.02,394.27 378.71,394.27 377.95,395.03 371.6,395.03 370.59,394.02 A11.B2 369.32,394.27 368.81,394.78 364.49,394.78 364.24,395.03 361.44,395.03 360.43,394.02 357.89,394.02 A12.B2 356.62,394.27 356.11,394.78 351.79,394.78 351.54,395.03 343.41,395.03 343.28,394.91 | 266.95,395.03 257.3,395.03 256.29,394.02 A20.B2 255.02,394.27 254.51,394.78 250.19,394.78 249.94,395.03 247.14,395.03 246.13,394.02 243.59,394.02 A21.B2 242.32,394.27 241.81,394.78 237.49,394.78 237.24,395.03 234.44,395.03 233.43,394.02 230.89,394.02 A22.B2 229.62,394.27 229.11,394.78 224.79,394.78 224.54,395.03 221.74,395.03 220.73,394.02 218.19,394.02 A23.B2 216.92,394.27 216.41,394.78 212.09,394.78 211.84,395.03 209.04,395.03 208.03,394.02 205.49,394.02 A24.B2 204.22,394.27 203.71,394.78 199.39,394.78 199.14,395.03 196.34,395.03 195.33,394.02 192.79,394.02 A25.B2 191.52,394.27 191.01,394.78 186.69,394.78 186.44,395.03 183.64,395.03 182.63,394.02 180.09,394.02 A26.B2 178.82,394.27 178.31,394.78 173.99,394.78 173.74,395.03 170.94,395.03 169.93,394.02 167.39,394.02 A27.B2 166.12,394.27 165.61,394.78 161.29,394.78 161.04,395.03 158.24,395.03 157.23,394.02 154.69,394.02 A28.B2 153.42,394.27 152.91,394.78 148.59,394.78 148.34,395.03 145.54,395.03 144.53,394.02 141.99,394.02 A29.B2 140.72,394.27 140.21,394.78 135.89,394.78 135.64,395.03 130.81,395.03 129.79,394.02 129.29,394.02 A30.B2 128.02,394.27 127.76,394.53 123.44,394.53 122.94,395.03 114.81,395.03 114.55,395.03
  Bottom 0.635: 266.95,395.03 267.72,394.27 A19.B2 | 266.95,395.03 267.21,395.03 275.34,395.03 275.84,394.53 280.16,394.53 280.42,394.27 A18.B2 281.69,394.02 282.19,394.02 283.21,395.03 292.35,395.03 292.48,394.91 | 292.48,394.91 293.12,394.27 A17.B2 | 292.48,394.91 292.61,395.03 300.74,395.03 301.24,394.53 305.56,394.53 305.82,394.27 A16.B2 307.09,394.02 307.59,394.53 311.66,394.53 312.17,395.03 317.75,395.03 318.52,394.27 A15.B2 319.79,394.02 320.8,395.03 330.45,395.03 | 330.45,395.03 331.22,394.27 A14.B2 | 343.28,394.91 343.15,395.03 330.71,395.03 330.45,395.03 | 343.28,394.91 343.92,394.27 A13.B2 | 12.7,392.24 3.3,392.24 2.29,393.26 A40.B2 | 12.7,392.24 13.72,393.26 A39.B2 | 25.53,392.37 25.4,392.24 12.95,392.24 12.7,392.24 | 25.53,392.37 26.42,393.26 A38.B2 | 25.53,392.37 25.65,392.24 38.1,392.24 39.12,393.26 A37.B2 40.39,394.02 40.89,394.02 41.91,395.03 46.74,395.03 47.24,394.53 51.56,394.53 51.82,394.27 A36.B2 53.09,394.02 53.59,394.02 54.61,395.03 59.44,395.03 59.94,394.53 64.26,394.53 64.52,394.27 A35.B2 65.79,394.02 66.29,394.02 67.31,395.03 72.14,395.03 72.64,394.53 76.96,394.53 77.22,394.27 A34.B2 78.49,394.02 78.99,394.02 80.01,395.03 84.84,395.03 85.34,394.53 89.66,394.53 89.92,394.27 A33.B2 91.19,394.02 91.69,394.53 95.76,394.53 96.27,395.03 97.54,395.03 98.3,394.27 102.62,394.27 A32.B2 103.89,394.02 104.39,394.53 108.46,394.53 108.97,395.03 114.55,395.03 | 114.55,395.03 115.32,394.27 A31.B2 | 35.05,325.18 v35.05,325.44 | 444.5,189.04 435.1,189.04 434.09,190.06 D06.B2 432.82,191.07 432.56,191.33 428.24,191.33 427.74,191.83 422.91,191.83 421.89,190.82 421.39,190.82 D07.B2 420.12,191.07 419.86,191.33 415.54,191.33 415.04,191.83 410.21,191.83 409.19,190.82 408.69,190.82 D08.B2 407.42,191.07 407.16,191.33 402.84,191.33 402.34,191.83 397.51,191.83 396.49,190.82 395.99,190.82 D09.B2 394.72,191.07 394.46,191.33 390.14,191.33 389.64,191.83 384.81,191.83 383.79,190.82 383.29,190.82 D10.B2 382.02,191.07 381.76,191.33 377.44,191.33 376.94,191.83 372.11,191.83 371.09,190.82 370.59,190.82 D11.B2 369.32,190.06 365.51,190.06 364.49,189.04 358.9,189.04 357.89,190.06 D12.B2 356.62,191.07 356.36,191.33 352.04,191.33 351.54,191.83 346.71,191.83 345.69,190.82 345.19,190.82 D13.B2 343.92,191.07 343.66,191.33 339.34,191.33 338.84,191.83 334.01,191.83 332.99,190.82 332.49,190.82 D14.B2 331.22,191.07 330.96,191.33 326.64,191.33 326.14,191.83 321.31,191.83 320.29,190.82 319.79,190.82 D15.B2 318.52,191.07 318.26,191.33 313.94,191.33 313.44,191.83 308.61,191.83 307.59,190.82 307.09,190.82 D16.B2 305.82,191.07 305.56,191.33 301.24,191.33 300.74,191.83 295.91,191.83 294.89,190.82 294.39,190.82 D17.B2 293.12,191.07 292.86,191.33 288.54,191.33 288.04,191.83 283.21,191.83 282.19,190.82 281.69,190.82 D18.B2 280.42,191.07 280.16,191.33 275.84,191.33 275.34,191.83 270.51,191.83 269.49,190.82 268.99,190.82 D19.B2 267.72,191.07 267.46,191.33 263.14,191.33 262.64,191.83 257.3,191.83 256.29,190.82 D20.B2 255.02,191.07 251.71,191.07 250.95,191.83 244.6,191.83 243.59,190.82 D21.B2 242.32,190.06 241.3,189.04 232.66,189.04 231.65,190.06 230.89,190.06 D22.B2 229.62,191.07 229.36,191.33 225.04,191.33 224.54,191.83 219.71,191.83 218.69,190.82 218.19,190.82 D23.B2 216.92,191.07 216.66,191.33 212.34,191.33 211.84,191.83 207.01,191.83 205.99,190.82 205.49,190.82 D24.B2 204.22,191.07 203.96,191.33 199.64,191.33 199.14,191.83 194.31,191.83 193.29,190.82 192.79,190.82 D25.B2 191.52,191.07 191.26,191.33 186.94,191.33 186.44,191.83 181.61,191.83 180.59,190.82 180.09,190.82 D26.B2 178.82,191.07 178.56,191.33 174.24,191.33 173.74,191.83 168.91,191.83 167.89,190.82 167.39,190.82 D27.B2 166.12,191.07 165.86,191.33 161.54,191.33 161.04,191.83 156.21,191.83 155.19,190.82 154.69,190.82 D28.B2 153.42,191.07 153.16,191.33 148.84,191.33 148.34,191.83 143.51,191.83 142.49,190.82 141.99,190.82 D29.B2 140.72,191.07 137.41,191.07 136.65,191.83 130.3,191.83 129.29,190.82 D30.B2 128.02,191.07 124.71,191.07 123.95,191.83 121.67,191.83 121.16,191.33 117.09,191.33 116.59,190.82 D31.B2 115.32,191.07 115.06,191.33 110.74,191.33 110.24,191.83 105.41,191.83 104.39,190.82 103.89,190.82 D32.B2 102.62,191.07 102.36,191.33 98.04,191.33 97.54,191.83
  Bottom 0.635: 444.5,189.04 445.52,190.06 D05.B2 | 457.33,189.17 457.2,189.04 444.75,189.04 444.5,189.04 | 457.33,189.17 458.22,190.06 D04.B2 | D03.B2 470.92,190.06 469.9,189.04 457.45,189.04 457.33,189.17 | 89.15,191.83 83.57,191.83 83.06,191.33 78.99,191.33 78.49,190.82 D34.B2 77.22,191.07 76.96,191.33 72.64,191.33 72.14,191.83 69.34,191.83 68.33,190.82 65.79,190.82 D35.B2 64.52,191.07 64.26,191.33 59.94,191.33 59.44,191.83 54.61,191.83 53.59,190.82 53.09,190.82 D36.B2 51.82,191.07 51.56,191.33 47.24,191.33 46.74,191.83 41.91,191.83 40.89,190.82 40.39,190.82 D37.B2 39.12,191.07 38.86,191.33 34.54,191.33 34.04,191.83 25.91,191.83 25.65,191.83 | 89.15,191.83 89.92,191.07 D33.B2 | v97.28,191.83 89.41,191.83 89.15,191.83 | v97.28,191.83 97.54,191.83 | 25.65,191.83 16,191.83 14.99,190.82 D39.B2 | 25.65,191.83 26.42,191.07 D38.B2 | 330.2,258.89 320.8,258.89 319.79,259.91 C15.B2 318.52,260.92 318.26,261.18 313.94,261.18 313.44,261.68 308.61,261.68 307.59,260.67 307.09,260.67 C16.B2 305.82,260.92 305.56,261.18 301.24,261.18 300.74,261.68 295.91,261.68 294.89,260.67 294.39,260.67 C17.B2 293.12,260.92 292.86,261.18 288.54,261.18 288.04,261.68 283.21,261.68 282.19,260.67 281.69,260.67 C18.B2 280.42,260.92 280.16,261.18 275.84,261.18 275.34,261.68 270.51,261.68 269.49,260.67 268.99,260.67 C19.B2 267.72,260.92 267.46,261.18 263.14,261.18 262.64,261.68 257.81,261.68 256.79,260.67 256.29,260.67 C20.B2 255.02,260.92 254.76,261.18 250.44,261.18 249.94,261.68 245.11,261.68 244.09,260.67 243.59,260.67 C21.B2 242.32,259.91 241.3,258.89 232.66,258.89 231.65,259.91 230.89,259.91 C22.B2 229.62,260.92 229.36,261.18 225.04,261.18 224.54,261.68 219.71,261.68 218.69,260.67 218.19,260.67 C23.B2 216.92,260.92 216.66,261.18 212.34,261.18 211.84,261.68 207.01,261.68 205.99,260.67 205.49,260.67 C24.B2 204.22,260.92 200.91,260.92 200.15,261.68 193.8,261.68 192.79,260.67 C25.B2 191.52,260.92 191.26,261.18 186.94,261.18 186.44,261.68 181.61,261.68 180.59,260.67 180.09,260.67 C26.B2 178.82,260.92 178.56,261.18 174.24,261.18 173.74,261.68 168.91,261.68 167.89,260.67 167.39,260.67 C27.B2 166.12,260.92 165.86,261.18 161.54,261.18 161.04,261.68 156.21,261.68 155.19,260.67 154.69,260.67 C28.B2 153.42,260.92 153.16,261.18 148.84,261.18 148.34,261.68 143.51,261.68 142.49,260.67 141.99,260.67 C29.B2 140.72,260.92 140.46,261.18 136.14,261.18 135.64,261.68 130.81,261.68 129.79,260.67 129.29,260.67 C30.B2 128.02,260.92 127.76,261.18 123.44,261.18 122.94,261.68 118.11,261.68 117.09,260.67 116.59,260.67 C31.B2 115.32,260.92 115.06,261.18 110.74,261.18 110.24,261.68 105.41,261.68 104.39,260.67 103.89,260.67 C32.B2 102.62,260.92 102.36,261.18 98.04,261.18 97.54,261.68 92.71,261.68 91.69,260.67 91.19,260.67 C33.B2 89.92,260.92 89.66,261.18 85.34,261.18 84.84,261.68 80.01,261.68 78.99,260.67 78.49,260.67 C34.B2 77.22,260.92 76.96,261.18 72.64,261.18 72.14,261.68 67.31,261.68 66.29,260.67 65.79,260.67 C35.B2 64.52,260.92 64.26,261.18 59.94,261.18 59.44,261.68 54.61,261.68 53.59,260.67 53.09,260.67 C36.B2 51.82,260.92 51.56,261.18 47.24,261.18 46.74,261.68 41.91,261.68 40.89,260.67 40.39,260.67 C37.B2 39.12,260.92 38.86,261.18 34.54,261.18 34.04,261.68 25.91,261.68 25.78,261.56
  Bottom 0.635: 330.2,258.89 331.22,259.91 C14.B2 | 330.2,258.89 330.45,258.89 342.9,258.89 343.92,259.91 C13.B2 345.19,260.67 346.2,261.68 351.54,261.68 352.04,261.18 356.36,261.18 356.62,260.92 C12.B2 357.89,260.67 358.39,260.67 359.41,261.68 364.24,261.68 364.74,261.18 369.06,261.18 369.32,260.92 C11.B2 370.59,260.67 371.09,260.67 372.11,261.68 376.94,261.68 377.44,261.18 381.76,261.18 382.02,260.92 C10.B2 383.29,260.67 383.79,260.67 384.81,261.68 389.64,261.68 390.14,261.18 394.46,261.18 394.72,260.92 C09.B2 395.99,260.67 396.49,260.67 397.51,261.68 402.34,261.68 402.84,261.18 407.16,261.18 407.42,260.92 C08.B2 408.69,260.67 409.19,260.67 410.21,261.68 415.04,261.68 415.54,261.18 419.86,261.18 420.12,260.92 C07.B2 421.39,260.67 421.89,260.67 422.91,261.68 427.74,261.68 428.24,261.18 432.56,261.18 432.82,260.92 C06.B2 434.09,260.67 434.59,260.67 435.61,261.68 440.44,261.68 440.94,261.18 445.26,261.18 445.52,260.92 C05.B2 446.79,260.67 447.29,260.67 448.31,261.68 453.14,261.68 453.64,261.18 457.96,261.18 458.22,260.92 C04.B2 459.49,260.16 462.28,260.16 463.55,258.89 469.9,258.89 470.92,259.91 C03.B2 | 12.95,261.68 9.4,261.68 | 9.4,261.68 3.3,261.68 2.29,260.67 C40.B2 | 12.95,261.68 13.72,260.92 C39.B2 | 25.78,261.56 25.65,261.68 13.21,261.68 12.95,261.68 | 25.78,261.56 26.42,260.92 C38.B2 | v97.28,191.83 97.54,191.83 | 444.75,128.33 439.17,128.33 438.66,127.83 434.59,127.83 434.09,127.32 E06.B2 432.82,127.57 432.56,127.83 428.24,127.83 427.74,128.33 422.91,128.33 421.89,127.32 421.39,127.32 E07.B2 420.12,127.57 419.86,127.83 415.54,127.83 415.04,128.33 410.21,128.33 409.19,127.32 408.69,127.32 E08.B2 407.42,127.57 407.16,127.83 402.84,127.83 402.34,128.33 397.51,128.33 396.49,127.32 395.99,127.32 E09.B2 394.72,127.57 394.46,127.83 390.14,127.83 389.64,128.33 384.81,128.33 383.79,127.32 383.29,127.32 E10.B2 382.02,127.57 381.76,127.83 377.44,127.83 376.94,128.33 368.81,128.33 368.68,128.21
  Bottom 0.635: 444.75,128.33 445.52,127.57 E05.B2 | 457.58,128.21 457.45,128.33 445.01,128.33 444.75,128.33 | 457.58,128.21 458.22,127.57 E04.B2 | E03.B2 470.92,127.57 470.15,128.33 457.71,128.33 457.58,128.21 | 368.68,128.21 368.55,128.33 359.41,128.33 358.39,127.32 357.89,127.32 E12.B2 356.62,127.57 353.31,127.57 352.55,128.33 346.2,128.33 345.19,127.32 E13.B2 343.92,127.57 343.66,127.83 339.34,127.83 338.84,128.33 334.01,128.33 332.99,127.32 332.49,127.32 E14.B2 331.22,127.57 330.96,127.83 326.64,127.83 326.14,128.33 321.31,128.33 320.29,127.32 319.79,127.32 E15.B2 318.52,127.57 318.26,127.83 313.94,127.83 313.44,128.33 308.61,128.33 307.59,127.32 307.09,127.32 E16.B2 305.82,127.57 305.56,127.83 301.24,127.83 300.74,128.33 295.91,128.33 294.89,127.32 294.39,127.32 E17.B2 293.12,127.57 292.86,127.83 288.54,127.83 288.04,128.33 283.21,128.33 282.19,127.32 281.69,127.32 E18.B2 280.42,127.57 280.16,127.83 275.84,127.83 275.34,128.33 270.51,128.33 269.49,127.32 268.99,127.32 E19.B2 267.72,127.57 267.46,127.83 263.14,127.83 262.64,128.33 257.81,128.33 256.79,127.32 256.29,127.32 E20.B2 255.02,127.57 254.76,127.83 250.44,127.83 249.94,128.33 245.11,128.33 244.09,127.32 243.59,127.32 E21.B2 242.32,127.57 242.06,127.83 237.74,127.83 237.24,128.33 232.41,128.33 231.39,127.32 230.89,127.32 E22.B2 229.62,127.57 229.36,127.83 225.04,127.83 224.54,128.33 219.71,128.33 218.69,127.32 218.19,127.32 E23.B2 216.92,127.57 216.66,127.83 212.34,127.83 211.84,128.33 207.01,128.33 205.99,127.32 205.49,127.32 E24.B2 204.22,127.57 203.96,127.83 199.64,127.83 199.14,128.33 194.31,128.33 193.29,127.32 192.79,127.32 E25.B2 191.52,127.57 191.26,127.83 186.94,127.83 186.44,128.33 181.61,128.33 180.59,127.32 180.09,127.32 E26.B2 178.82,127.57 178.56,127.83 174.24,127.83 173.74,128.33 168.91,128.33 167.89,127.32 167.39,127.32 E27.B2 166.12,127.57 165.86,127.83 161.54,127.83 161.04,128.33 152.91,128.33 152.65,128.33
  Bottom 0.635: 368.68,128.21 369.32,127.57 E11.B2 | 63.75,128.33 54.1,128.33 53.09,127.32 E36.B2 | 63.75,128.33 64.52,127.57 E35.B2 | 76.58,128.21 76.45,128.33 64.01,128.33 63.75,128.33 | 76.58,128.21 77.22,127.57 E34.B2 | E33.B2 89.92,127.57 89.66,127.83 85.34,127.83 84.84,128.33 76.71,128.33 76.58,128.21 | 152.65,128.33 147.07,128.33 146.81,128.08 142.75,128.08 141.99,127.32 E29.B2 | 152.65,128.33 153.42,127.57 E28.B2 | v91.44,130.11 94.23,132.91 98.3,132.91 | v140.97,132.91 98.3,132.91 | 292.35,58.48 286.77,58.48 286.26,57.98 282.19,57.98 281.69,57.47 F18.B2 280.42,57.72 280.16,57.98 275.84,57.98 275.34,58.48 270.51,58.48 269.49,57.47 268.99,57.47 F19.B2 267.72,57.72 267.46,57.98 263.14,57.98 262.64,58.48 257.81,58.48 256.79,57.47 256.29,57.47 F20.B2 255.02,57.72 254.76,57.98 250.44,57.98 249.94,58.48 245.11,58.48 244.09,57.47 243.59,57.47 F21.B2 242.32,57.72 242.06,57.98 237.74,57.98 237.24,58.48 232.41,58.48 231.39,57.47 230.89,57.47 F22.B2 229.62,57.72 229.36,57.98 225.04,57.98 224.54,58.48 219.71,58.48 218.69,57.47 218.19,57.47 F23.B2 216.92,57.72 216.66,57.98 212.34,57.98 211.84,58.48 203.71,58.48 203.45,58.48 | 292.35,58.48 293.12,57.72 F17.B2 | 292.35,58.48 292.61,58.48 300.74,58.48 301.24,57.98 305.56,57.98 305.82,57.72 F16.B2 307.09,57.47 307.59,57.47 308.61,58.48 313.44,58.48 313.94,57.98 318.26,57.98 318.52,57.72 F15.B2 319.79,57.47 320.29,57.47 321.31,58.48 326.14,58.48 326.64,57.98 330.96,57.98 331.22,57.72 F14.B2 332.49,57.47 332.99,57.47 334.01,58.48 338.84,58.48 339.34,57.98 343.66,57.98 343.92,57.72 F13.B2 345.19,57.47 345.69,57.47 346.71,58.48 351.54,58.48 352.04,57.98 356.36,57.98 356.62,57.72 F12.B2 357.89,57.47 358.39,57.47 359.41,58.48 364.24,58.48 364.74,57.98 369.06,57.98 369.32,57.72 F11.B2 370.59,57.47 371.09,57.47 372.11,58.48 376.94,58.48 377.44,57.98 381.76,57.98 382.02,57.72 F10.B2 383.29,57.47 383.79,57.47 384.81,58.48 389.64,58.48 390.14,57.98 394.46,57.98 394.72,57.72 F09.B2 395.99,57.47 396.49,57.47 397.51,58.48 402.34,58.48 402.84,57.98 407.16,57.98 407.42,57.72 F08.B2 408.69,57.47 409.19,57.47 410.21,58.48 415.04,58.48 415.54,57.98 419.86,57.98 420.12,57.72 F07.B2 421.39,57.47 421.89,57.47 422.91,58.48 427.74,58.48 428.24,57.98 432.56,57.98 432.82,57.72 F06.B2 434.09,57.47 434.59,57.47 435.61,58.48 440.44,58.48 440.94,57.98 445.26,57.98 445.52,57.72 F05.B2 446.79,57.47 447.29,57.47 448.31,58.48 453.14,58.48 453.64,57.98 457.96,57.98 458.22,57.72 F04.B2 459.49,57.47 459.99,57.47 461.01,58.48 465.84,58.48 466.34,57.98 470.66,57.98 470.92,57.72 F03.B2
  Bottom 0.635: 12.95,58.48 3.3,58.48 2.29,57.47 F40.B2 | 12.95,58.48 13.72,57.72 F39.B2 | 25.78,58.36 25.65,58.48 13.21,58.48 12.95,58.48 | 25.78,58.36 26.42,57.72 F38.B2 | 38.48,58.36 38.35,58.48 25.91,58.48 25.78,58.36 | 38.48,58.36 39.12,57.72 F37.B2 | 51.18,58.36 51.05,58.48 38.61,58.48 38.48,58.36 | 51.18,58.36 51.82,57.72 F36.B2 | 63.88,58.36 63.75,58.48 51.31,58.48 51.18,58.36 | 63.88,58.36 64.52,57.72 F35.B2 | 63.88,58.36 64.01,58.48 76.45,58.48 77.22,57.72 F34.B2 78.49,56.71 79.5,55.69 88.9,55.69 89.92,56.71 F33.B2 | 165.35,58.48 155.7,58.48 154.69,57.47 F28.B2 | 165.35,58.48 166.12,57.72 F27.B2 | 165.35,58.48 165.61,58.48 173.74,58.48 174.24,57.98 178.56,57.98 178.82,57.72 F26.B2 180.09,57.47 180.59,57.98 184.66,57.98 185.17,58.48 187.45,58.48 188.21,57.72 191.52,57.72 F25.B2 192.79,57.47 193.29,57.98 197.36,57.98 197.87,58.48 203.45,58.48 | 203.45,58.48 204.22,57.72 F24.B2 | v91.95,60.77 94.49,63.31 v150.88,63.31 | v98.3,134.68 98.3,133.16 98.3,132.91 | v9.4,263.72 9.4,261.94 9.4,261.68 | v9.4,322.14 9.4,322.39
-(DP+EP)  (via drill 0.61)
  Top 0.254: v332.74,345.5 330.45,345.5 330.45,338.14 | 330.45,338.14 330.45,295.21 333.25,292.42 333.25,278.19 334.52,276.92 B14.U2 | v330.96,338.14 330.45,338.14 | v276.35,338.65 276.35,335.85 275.59,335.09 273.3,335.09 273.3,356.93 272.03,358.2 A19.P2
  Bottom 0.254: B18.T2 281.69,278.96 282.96,277.69 313.94,277.69 314.96,278.7 318.01,278.7 318.52,278.19 332.74,278.19 334.26,276.67 B14.U2 | v332.74,345.5 333.5,344.74 345.95,344.74 346.96,345.76 A13.U2 | 156.72,359.98 156.72,363.28 54.1,363.28 53.09,362.27 A36.N2 | 156.72,359.98 156.72,359.47 A28.P2 | 156.72,359.98 208.53,359.98 211.07,357.44 265.43,357.44 266.7,358.71 270.76,358.71 A19.P2 | v330.96,338.14 296.67,338.14 296.16,338.65 v276.35,338.65
-(EX+DC)  (via drill 0.61)
  Top 0.254: v89.15,221.04 88.65,221.55 88.65,315.28 90.17,316.8 B33.D2 | v356.36,319.34 355.85,319.85 355.85,322.39 | 355.85,322.39 355.85,364.05 358.39,366.59 358.39,387.92 357.63,388.68 344.93,388.68 344.93,387.92 A13.D2 | v414.78,251.27 415.54,252.03 415.54,311.72 v414.78,312.48 | 355.85,322.39 v356.36,322.39
  Bottom 0.254: v89.15,221.04 28.45,221.04 27.69,221.81 C38.R2 | v356.36,319.34 344.42,319.34 343.66,318.58 340.36,318.58 340.11,318.83 333.5,318.83 332.49,317.82 B14.D2 331.22,318.07 330.45,318.83 92.2,318.83 91.19,317.82 B33.D2 | v414.78,251.27 411.73,251.27 C08.E2 | v414.78,312.48 411.48,315.79 400.56,315.79 393.95,322.39 v356.36,322.39
-(IAC+CMA)  (via drill 0.61)
  Top 0.254: v372.11,13.02 380.75,21.65 380.75,60.26 v383.03,62.55 | v386.08,62.8 385.57,63.31 385.57,77.79 381.25,82.11 381.25,87.19 382.27,88.2 E10.R2
  Route2 0.254: v339.85,9.72 341.63,11.49 370.59,11.49 v372.11,13.02 | v383.03,62.55 383.29,62.8 v386.08,62.8
  Route3 0.254: B21.H2 246.63,307.4 247.4,306.64 247.4,299.78 244.09,296.48 244.09,244.67 244.35,244.41 244.35,221.81 241.05,218.5 241.05,175.58 242.06,174.56 242.06,172.53 241.55,172.02 241.55,71.44 250.7,62.29 250.7,15.81 255.02,11.49 267.72,11.49 267.72,12.26 F19.T2
  Bottom 0.254: v339.85,9.72 338.84,9.72 336.8,7.68 268.73,7.68 268.73,12 F19.T2
-(ISZ*Z1)  (via drill 0.61)
  Top 0.254: v311.15,66.36 311.15,34.61 308.36,31.81 308.36,27.5 306.83,25.97 F16.N2 | v369.57,66.36 369.57,75.5 E11.V2
  Bottom 0.254: v311.15,66.36 311.66,65.85 343.15,65.85 343.66,66.36 v369.57,66.36
-(JMP+JMS)(B)
  Top 0.254: F31.P2 119.63,22.67 124.21,22.67 124.21,37.4 127.25,40.45 127.25,51.37 139.95,64.07 139.95,93.54 140.97,94.55 E29.N2
-(OP+IOT)  (via drill 0.61)
  Top 0.254: v295.4,385.13 295.4,352.11 296.16,351.35 296.16,350.33 295.66,349.82 295.66,313.75 296.16,313.25 296.16,311.72 295.15,310.71 295.15,287.34 294.13,286.32 B17.R2 293.37,285.05 292.35,284.04 292.35,276.16 295.66,272.86 295.66,242.13 v296.67,241.11 | v352.04,73.98 352.04,30.54 346.46,24.96 346.46,21.15 344.93,19.62 F13.R2 | v372.87,73.98 374.4,75.5 374.4,97.09 373.63,97.85 E11.M2 | v402.34,155 402.84,154.5 402.84,106.74 v401.32,105.22 | v358.9,209.61 358.39,209.11 358.39,170.75 359.16,169.99 359.16,167.2 v360.93,165.42
  Route2 0.254: v360.93,165.42 363.22,163.13 368.55,163.13 374.9,156.78 400.56,156.78 402.08,155.26 v402.34,155
  Route3 0.254: v296.67,241.11 299.21,238.57 v299.21,236.54 | v346.71,234.76 346.46,234.51 346.46,229.17 358.9,216.73 v358.9,209.61
  Bottom 0.254: v295.4,385.13 295.66,385.38 320.8,385.38 321.56,384.62 A15.E2 | v372.87,73.98 v352.04,73.98 | v402.34,155 407.42,160.08 421.64,160.08 423.16,161.61 D07.M2 | v401.32,105.22 396.49,100.39 372.11,100.39 371.6,100.9 371.09,100.9 370.33,100.14 370.33,98.87 372.36,98.87 E11.M2 | v299.21,236.54 299.47,236.28 318.01,236.28 319.28,237.55 321.06,237.55 322.33,236.28 345.19,236.28 v346.71,234.76
-(SP+PCP)  (via drill 0.61)
  Top 0.254: 270.26,46.29 271.02,47.05 F19.E2 | 270.26,46.29 270.26,26.73 v280.67,16.32 | v388.11,105.22 386.84,106.49 386.84,110.05 386.33,110.55 E10.H2 | 270.26,46.29 270.26,99.12 v272.03,100.9 271.78,101.16 270.26,102.68 270.26,271.59 v270.26,271.84 270.26,293.94 271.02,294.7 B19.M2 | v445.26,53.91 444.75,53.4 444.75,50.36 445.26,49.85 445.26,45.28 445.52,45.02 F05.F2 | v401.32,55.18 402.84,56.71 402.84,102.17 v401.32,103.7 | v164.85,310.96 164.85,274.89 166.12,273.62 B27.V2 167.13,272.35 v167.13,267.27 | A19.J2 267.97,373.95 266.95,372.94 266.95,344.23 267.72,343.47 A19.V2 267.97,342.2 266.45,340.68 v266.45,295.72 | B22.R2 230.63,285.05 231.65,284.04 v231.65,274.38 231.39,274.13 v231.39,268.29
  Route2 0.254: v401.32,103.7 401.07,103.44 389.89,103.44 388.37,104.97 v388.11,105.22 | A17.M2 296.16,365.57 294.64,367.09 277.62,367.09 270.51,374.21 268.99,374.21 A19.J2
  Bottom 0.254: v280.67,16.32 283.46,16.32 F18.S2 | v388.11,105.22 385.83,102.93 347.73,102.93 345.19,100.39 308.1,100.39 307.85,100.65 307.34,100.65 307.09,100.39 296.67,100.39 294.13,102.93 274.07,102.93 v272.03,100.9 | v445.26,53.91 443.99,55.18 v401.32,55.18 | v164.85,310.96 163.32,312.48 155.7,312.48 | 155.7,312.48 154.69,311.47 B28.F2 | 155.7,312.48 79.5,312.48 78.49,311.47 B34.F2 | v231.65,274.38 234.7,271.34 269.75,271.34 v270.26,271.84 | v266.45,295.72 270.76,295.72 B19.M2 | v167.13,267.27 167.64,267.78 215.39,267.78 216.41,268.8 230.89,268.8 v231.39,268.29
-(SP+PCP+LP)  (via drill 0.61)
  Top 0.254: v323.09,284.54 323.6,284.04 v323.6,275.15 | v230.63,276.67 230.63,278.7 B22.T2
  Route3 0.254: B10.F2 383.03,310.45 383.79,309.69 383.79,301.56 370.33,288.1 370.33,286.32 B11.R2 | v103.63,224.6 148.34,269.3 164.34,269.3 v164.34,270.32 | v212.34,271.84 218.69,278.19 229.62,278.19 229.62,278.96 B22.T2
  Bottom 0.254: B11.F2 370.59,310.71 371.35,309.94 381.25,309.94 382.02,310.71 B10.F2 | B10.R2 382.02,286.32 381.51,286.83 376.68,286.83 376.43,287.08 372.87,287.08 371.86,286.07 370.59,286.07 B11.R2 369.32,285.31 368.55,284.54 358.65,284.54 357.89,285.31 B12.R2 356.62,285.31 356.36,285.05 351.79,285.05 351.28,284.54 v323.09,284.54 | v103.63,224.6 103.12,224.09 44.2,224.09 43.43,224.85 C37.P2 | v164.34,270.32 165.86,271.84 v212.34,271.84 | v323.6,275.15 322.83,274.38 284.23,274.38 281.43,271.59 271.78,271.59 270.51,272.86 270,272.86 268.99,271.84 235.46,271.84 v230.63,276.67
-(WTX*IAC)  (via drill 0.61)
  Top 0.254: C12.V2 357.89,209.87 359.92,211.9 359.92,212.15 C12.U2 359.92,213.42 359.92,217.74 355.85,221.81 355.85,267.27 v357.38,268.8
  Route3 0.254: v357.38,268.8 355.35,270.83 355.35,302.07 346.46,310.96 346.46,366.08 344.93,367.6 A13.L2
-(WTX*ISZ)  (via drill 0.61)
  Top 0.254: v341.12,360.24 342.65,361.76 342.65,381.06 343.92,382.33 345.69,382.33 345.69,379.79 | 345.69,379.79 345.69,375.98 344.93,375.22 A13.J2 | v346.2,379.79 345.69,379.79 | C11.R2 370.33,222.82 371.35,223.84 v371.35,283.02 371.09,283.27 371.09,305.37 364.74,311.72 364.74,378.52 v364.49,378.78
  Bottom 0.254: v341.12,360.24 320.55,360.24 317.75,357.44 308.61,357.44 307.09,355.92 A16.R2 | 364.49,379.79 v346.2,379.79 | 364.49,379.79 381.25,379.79 382.02,380.56 A10.F2 | v371.35,283.02 372.36,284.04 398.27,284.04 401.83,287.59 409.45,287.59 410.46,288.61 B08.P2 | v364.49,378.78 364.49,379.79
-(WTX*JMS)  (via drill 0.61)
  Top 0.254: v381.51,219.52 378.21,222.82 378.21,365.57 378.97,366.33 382.02,366.33 382.02,362.52 A10.N2
  Route3 0.254: A09.E2 398.02,383.6 396.49,382.08 396.49,377.76 383.03,364.3 383.03,362.52 A10.N2
  Bottom 0.254: v381.51,219.52 385.06,219.52 C10.S2
-(WTX*OP2)  (via drill 0.61)
  Top 0.254: A18.K2 284.73,370.9 286,369.63 286,353.12 v289.56,349.57 289.31,349.31 286,346.01 286,308.93 288.54,306.39 288.54,270.57 v288.29,270.32 | v395.22,195.9 397,194.12 397,182.69 398.02,181.67 D09.E2 | v300.99,196.15 301.24,196.41 301.24,264.48 v300.99,264.73 300.74,264.99 300.74,269.3 v299.72,270.32 | v318.77,264.73 318.77,272.35 B15.V2
  Bottom 0.254: v289.56,349.57 291.08,348.04 305.05,348.04 305.82,348.81 A16.T2 | v395.22,195.9 394.97,196.15 345.95,196.15 345.44,195.64 323.85,195.64 323.34,196.15 v300.99,196.15 | v300.99,264.73 v318.77,264.73 | v299.72,270.32 v288.29,270.32
-(WTX*ROTR)  (via drill 0.61)
  Top 0.254: B27.F2 167.39,311.47 171.7,311.47 171.7,334.84 179.07,342.2 A26.V2 | v307.59,376.75 307.59,379.54 306.83,380.3 A16.F2 | v254.76,373.19 254.25,372.68 254.25,347.03 v254.76,346.52
  Bottom 0.254: v307.59,376.75 307.59,373.19 v254.76,373.19 | v254.76,346.52 252.48,344.23 181.1,344.23 180.09,343.22 A26.V2
-(WTX*TAD)  (via drill 0.61)
  Top 0.254: v286,378.27 286,382.33 284.73,383.6 A18.E2 | v385.57,278.7 387.1,277.18 387.1,252.54 386.08,251.52 C10.E2 | v341.63,280.23 340.11,281.75 340.11,335.09 340.87,335.85 v340.87,342.71 | v304.8,343.47 304.8,372.68 306.07,373.95 A16.J2
  Bottom 0.254: v286,378.27 288.29,375.98 305.05,375.98 305.82,375.22 A16.J2 | v385.57,278.7 385.06,278.19 343.92,278.19 341.88,280.23 v341.63,280.23 | v340.87,342.71 339.34,344.23 328.17,344.23 327.91,344.49 321.06,344.49 320.8,344.23 | 320.8,344.23 319.79,343.22 A15.V2 | v304.8,343.47 305.56,344.23 320.8,344.23
-[(ISZ*ZI)+JMS+(OP+IOT)*SKP+JMP]  (via drill 0.61)
  Top 0.254: v362.97,167.96 362.2,168.72 362.2,192.6 363.73,194.12 363.73,208.09 368.05,212.41 368.05,222.06 v367.03,223.08
  Route3 0.254: v274.83,61.02 269.75,55.94 269.75,46.04 268.73,45.02 F19.F2 | v337.82,62.8 340.11,62.8 340.11,63.82 355.85,79.57 355.85,91.25 359.16,94.55 359.16,137.73 362.2,140.78 362.2,167.2 v362.97,167.96 | v367.03,223.08 365.25,224.85 365.25,266.76 362.2,269.81 362.2,326.96 384.56,349.31 384.56,357.44 385.32,358.2 A10.P2
  Bottom 0.254: v274.83,61.02 277.11,63.31 334.52,63.31 335.03,63.82 336.8,63.82 v337.82,62.8
-[A12*(EX+DC+LD)]  (via drill 0.61)
  Top 0.254: v74.17,214.19 76.45,216.47 76.45,284.04 77.47,285.05 B34.R2 | v97.28,331.53 95.5,329.76 95.5,290.13 v96.52,289.12
  Route3 0.254: v334.77,333.31 336.3,334.84 336.3,362.01 343.66,369.38 343.66,369.63 351.28,369.63 351.79,369.13 351.79,368.87 356.62,368.87 A12.L2 | v206.25,334.84 173.48,334.84 v173.48,332.8
  Bottom 0.254: v74.17,214.19 31.75,214.19 30.73,213.17 C38.U2 | v334.77,333.31 334.52,333.06 249.68,333.06 248.92,333.82 216.92,333.82 215.9,334.84 v206.25,334.84 | v173.48,332.8 172.21,331.53 v97.28,331.53 | v96.52,289.12 94.49,287.08 83.31,287.08 82.3,286.07 78.49,286.07 B34.R2
-[WTD+WTE+WTF+EX+DC+(WTX*JMS)+WTB]
  Top 0.254: D09.L2 395.73,165.67 396.49,166.43 396.49,193.36 393.95,195.9 393.95,233.24 394.97,234.25 C09.L2
-[WTE*[(ISZ*ZI)+JMS+(OP+IOT)*SKP]]  (via drill 0.61)
  Top 0.254: v373.89,228.92 374.9,229.93 374.9,249.75 377.7,252.54 377.7,363.79 376.17,365.32 376.17,366.59 377.44,367.86 v377.44,377 | v322.58,356.93 322.58,353.12 A15.S2 | v351.03,360.49 352.04,361.51 352.04,371.67 348.23,375.48 348.23,377.25 A13.H2
  Bottom 0.254: A18.S2 284.73,352.87 285.24,353.38 289.81,353.38 290.07,353.63 317.75,353.63 318.52,352.87 321.56,352.87 A15.S2 | v373.89,228.92 370.59,228.92 C11.N2 | v377.44,377 376.94,376.49 349,376.49 348.23,377.25 A13.H2 | v322.58,356.93 323.09,357.44 344.42,357.44 347.47,360.49 v351.03,360.49
-[WTF*-(OP+IOT)]
  Route2 0.254: B17.S2 297.43,283.02 298.96,284.54 308.1,284.54 311.66,288.1 314.96,288.1 315.47,287.59 331.22,287.59 331.98,288.35 333.76,288.35 334.52,287.59 369.82,287.59 376.17,293.94 409.45,293.94 410.46,294.96 B08.M2
-[WTF+WTX*(JMP+JMS)+WTE+WTB+EX+DC+LD]
  Route2 0.254: B18.E2 284.73,313.75 286,312.48 288.54,312.48 292.86,308.17 292.86,306.13 295.91,306.13 301.75,300.29 349.76,300.29 352.3,302.83 390.14,302.83 393.45,306.13 406.65,306.13 407.42,305.37 B08.J2
-[WTX(TAD+IAC_CMA)]  (via drill 0.61)
  Top 0.254: v378.46,82.11 380.75,79.82 380.75,78.04 382.02,76.77 E10.V2 | v217.93,109.79 215.65,112.08 215.65,163.39 v214.12,164.91 | v170.69,171.77 168.66,173.8 168.66,214.19 168.91,214.44 168.91,218.25 168.4,218.76 168.4,288.61 165.35,291.66 165.35,303.09 166.37,304.1 B27.J2
  Route2 0.254: v325.12,84.9 324.1,83.88 249.68,83.88 223.77,109.79 v217.93,109.79 | v214.12,164.91 208.79,170.24 172.21,170.24 v170.69,171.77
  Bottom 0.254: v378.46,82.11 377.7,81.34 347.47,81.34 344.42,84.39 325.63,84.39 v325.12,84.9
-[WTX*(JMP+JMS)]  (via drill 0.61)
  Top 0.254: v393.45,369.63 393.45,363.79 394.72,362.52 A09.N2 | v351.03,370.65 349,368.62 349,349.31 346.46,346.77 346.46,315.79 347.22,315.02 B13.E2
  Bottom 0.254: B34.E2 81.53,313.75 82.3,312.99 251.21,312.99 251.71,312.48 294.39,312.48 294.89,312.99 345.95,312.99 346.96,314.01 B13.E2 | v393.45,369.63 392.94,370.14 351.54,370.14 v351.03,370.65
-A
  Top 0.254: B29.D2 141.73,316.8 142.75,315.79 142.75,303.59 144.02,302.32 B29.K2 | B31.T2 115.32,279.97 114.55,280.73 114.55,315.79 115.57,316.8 B31.D2 116.33,318.07 117.86,319.6 117.86,344.74 118.62,345.5 A31.U2 | B30.R2 128.02,286.32 127.25,287.08 127.25,315.79 128.27,316.8 B30.D2 128.02,318.07 127.25,318.83 127.25,343.47 129.54,345.76 131.06,345.76 A30.U2 | 104.39,363.28 104.65,363.54 104.65,369.63 105.16,370.14 | 104.39,363.28 103.63,362.52 A32.N2 | 105.16,370.14 105.92,370.9 A32.K2 | 104.39,363.28 104.39,348.3 105.92,346.77 A32.U2 | 105.16,370.14 105.16,385.13 103.63,386.65 A32.D2
  Route2 0.254: B19.D2 267.72,317.06 266.95,316.29 142.75,316.29 141.99,317.06 B29.D2 140.72,317.06 139.95,316.29 130.05,316.29 129.29,317.06 B30.D2